# Altium project INV.5KW.OG.PrjPcb (part 2 of 3)

## Sheet INV.Main.SchDoc
size 1549 x 599 mm; SheetNumber: 2; SheetTotal: 3
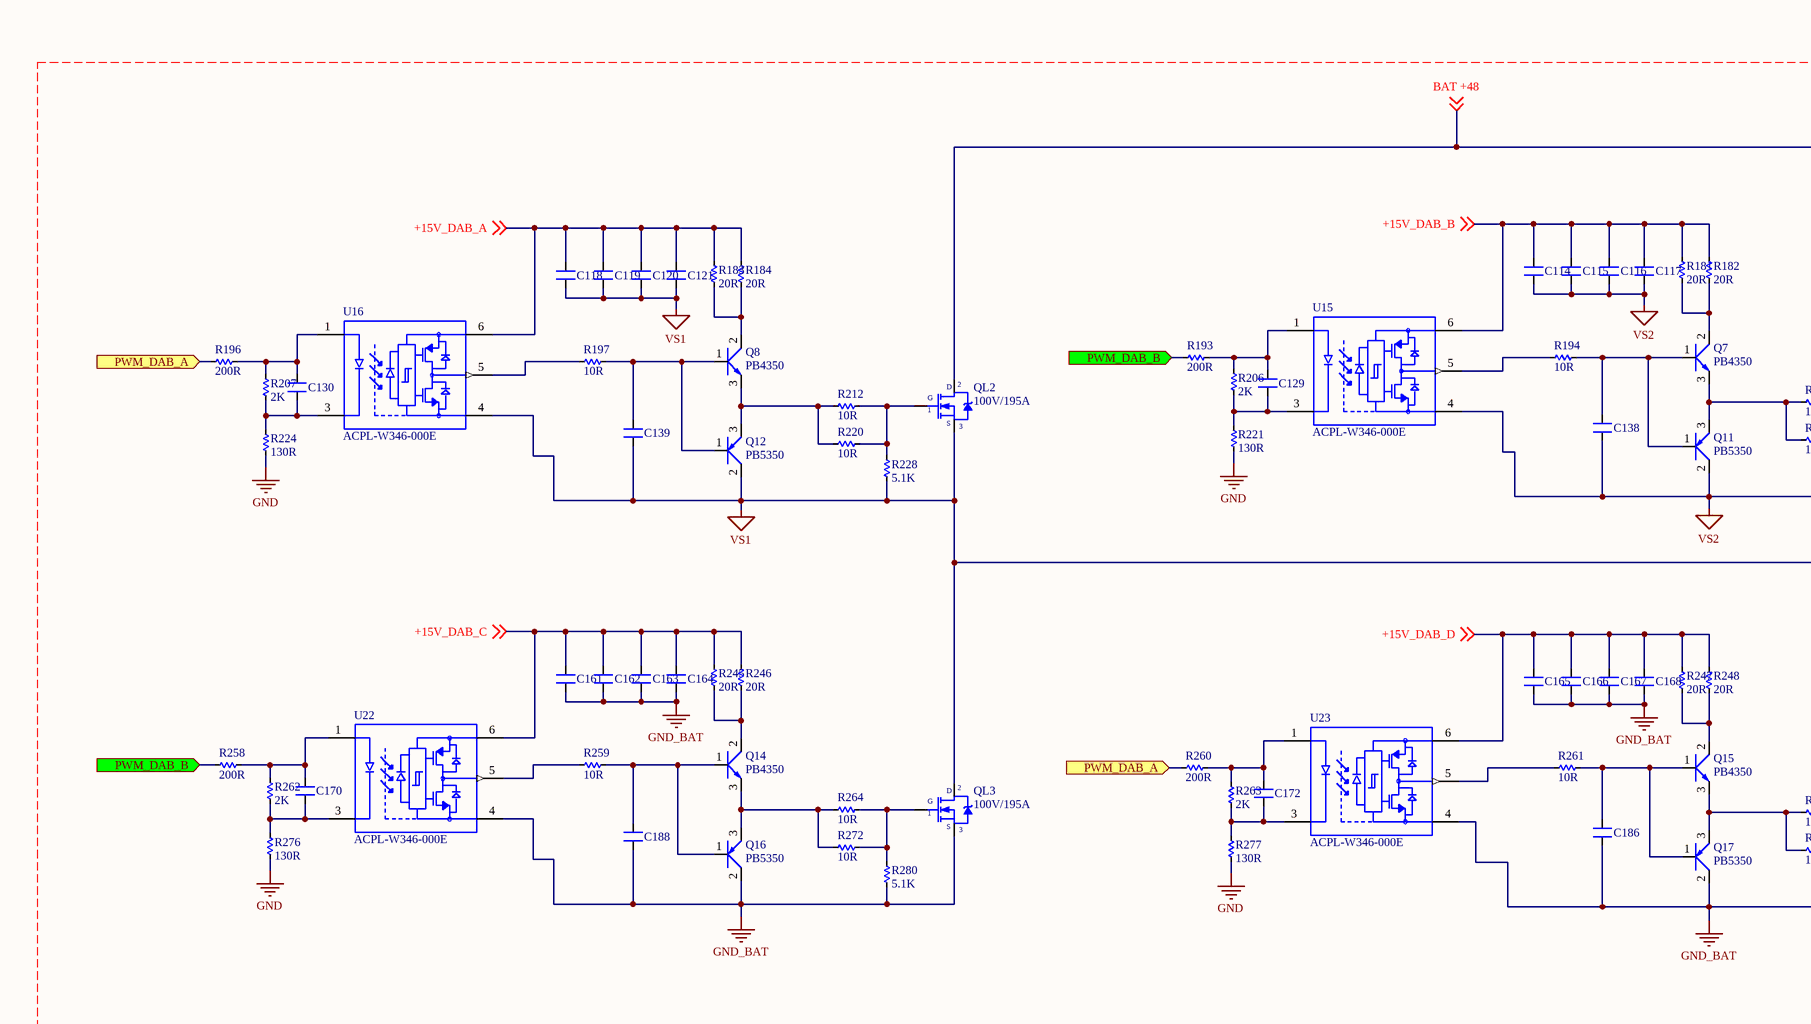
[diagram p3: INV.Main.SchDoc, top column 1 of 4]
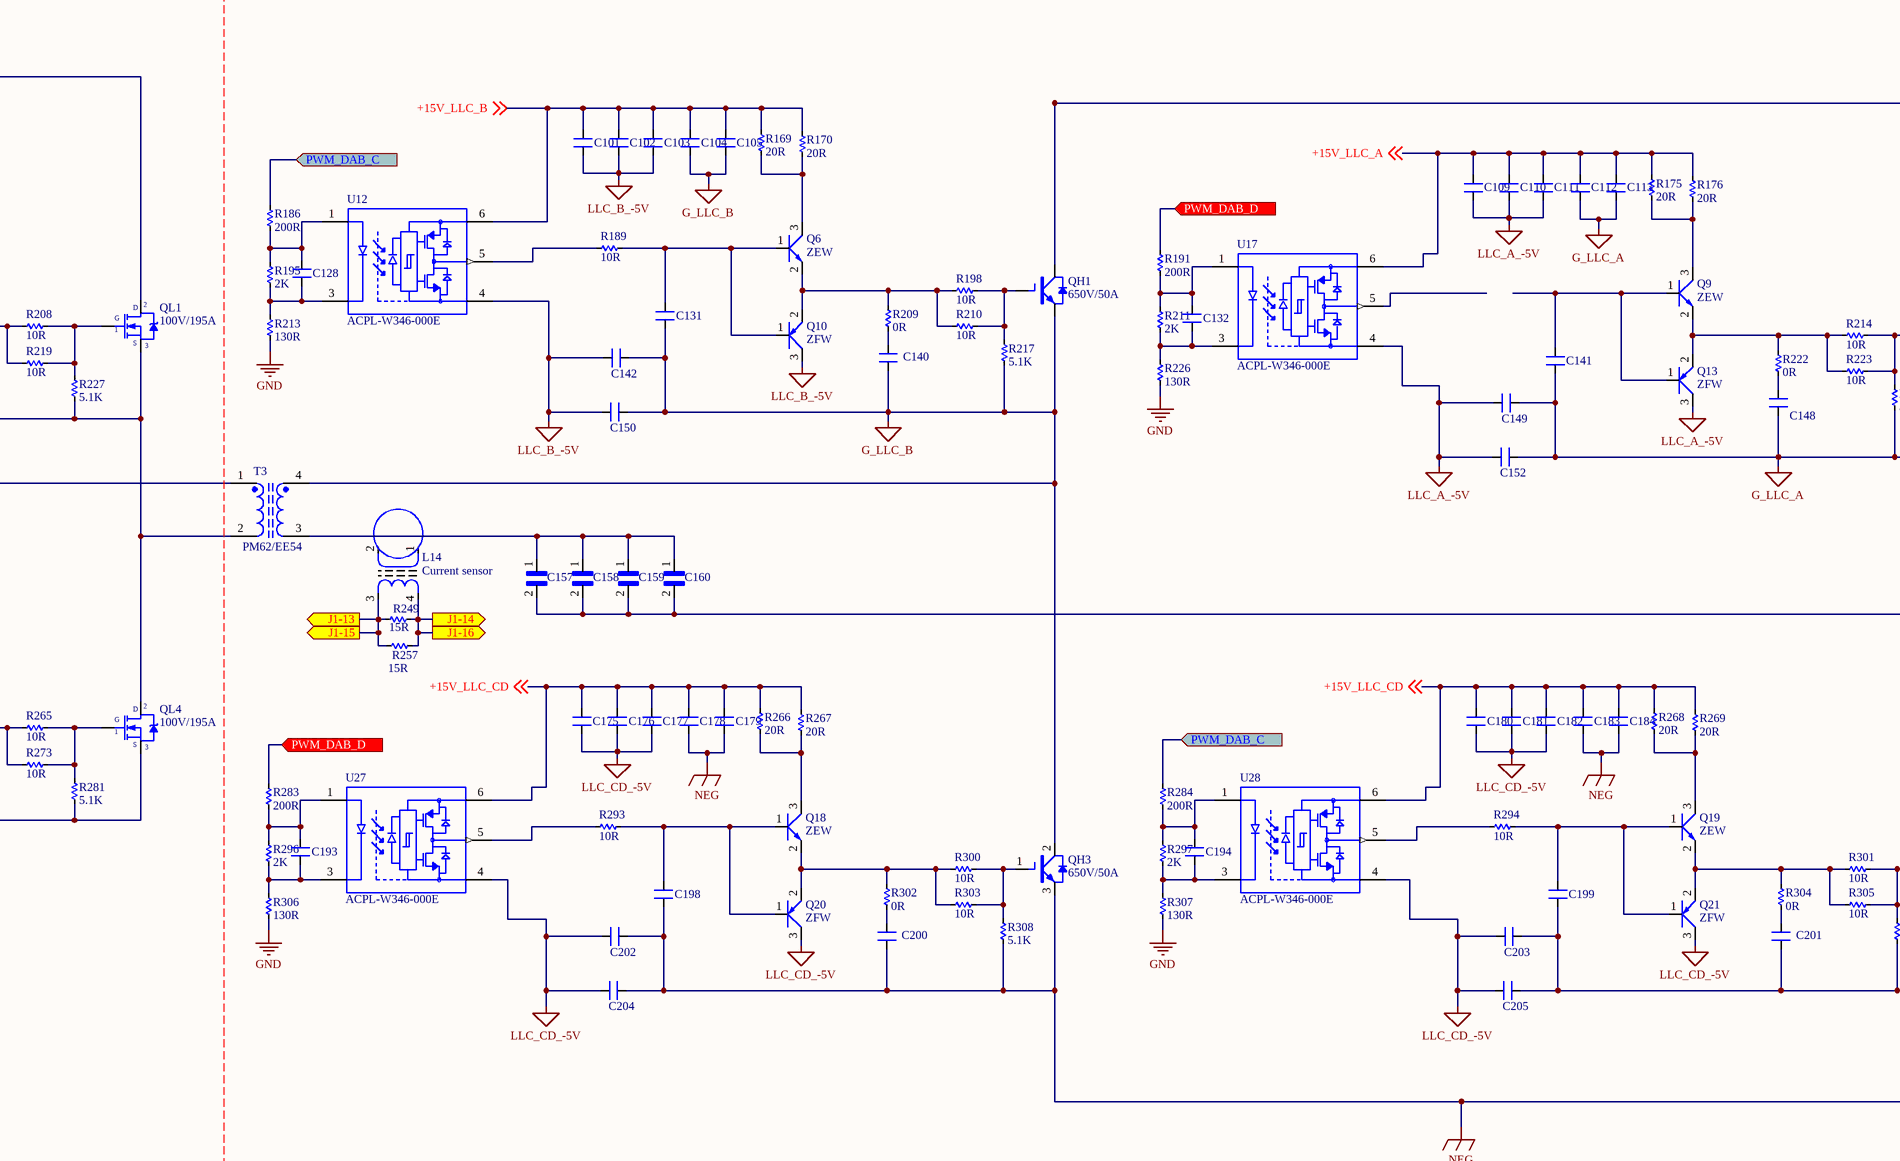
[diagram p4: INV.Main.SchDoc, top column 2 of 4]
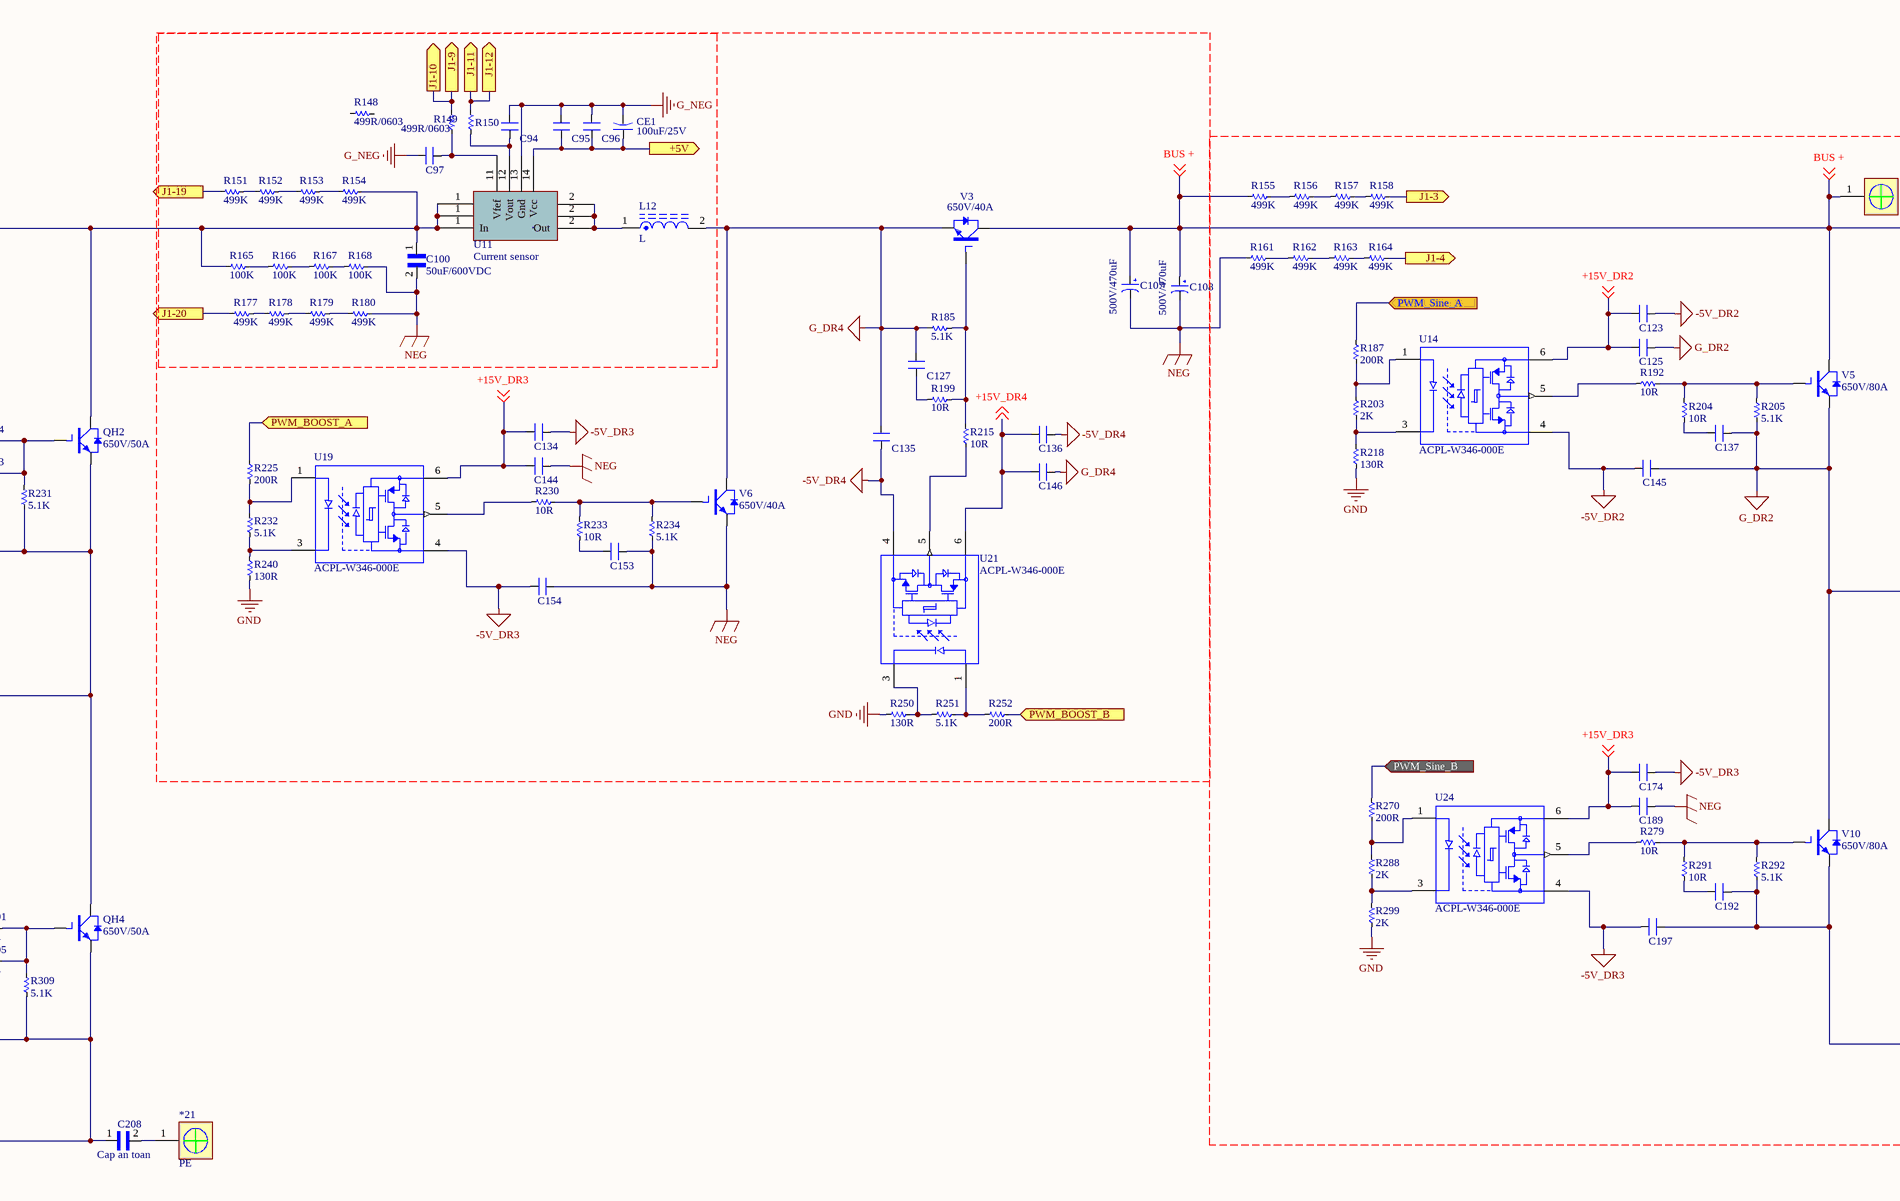
[diagram p5: INV.Main.SchDoc, top column 3 of 4]
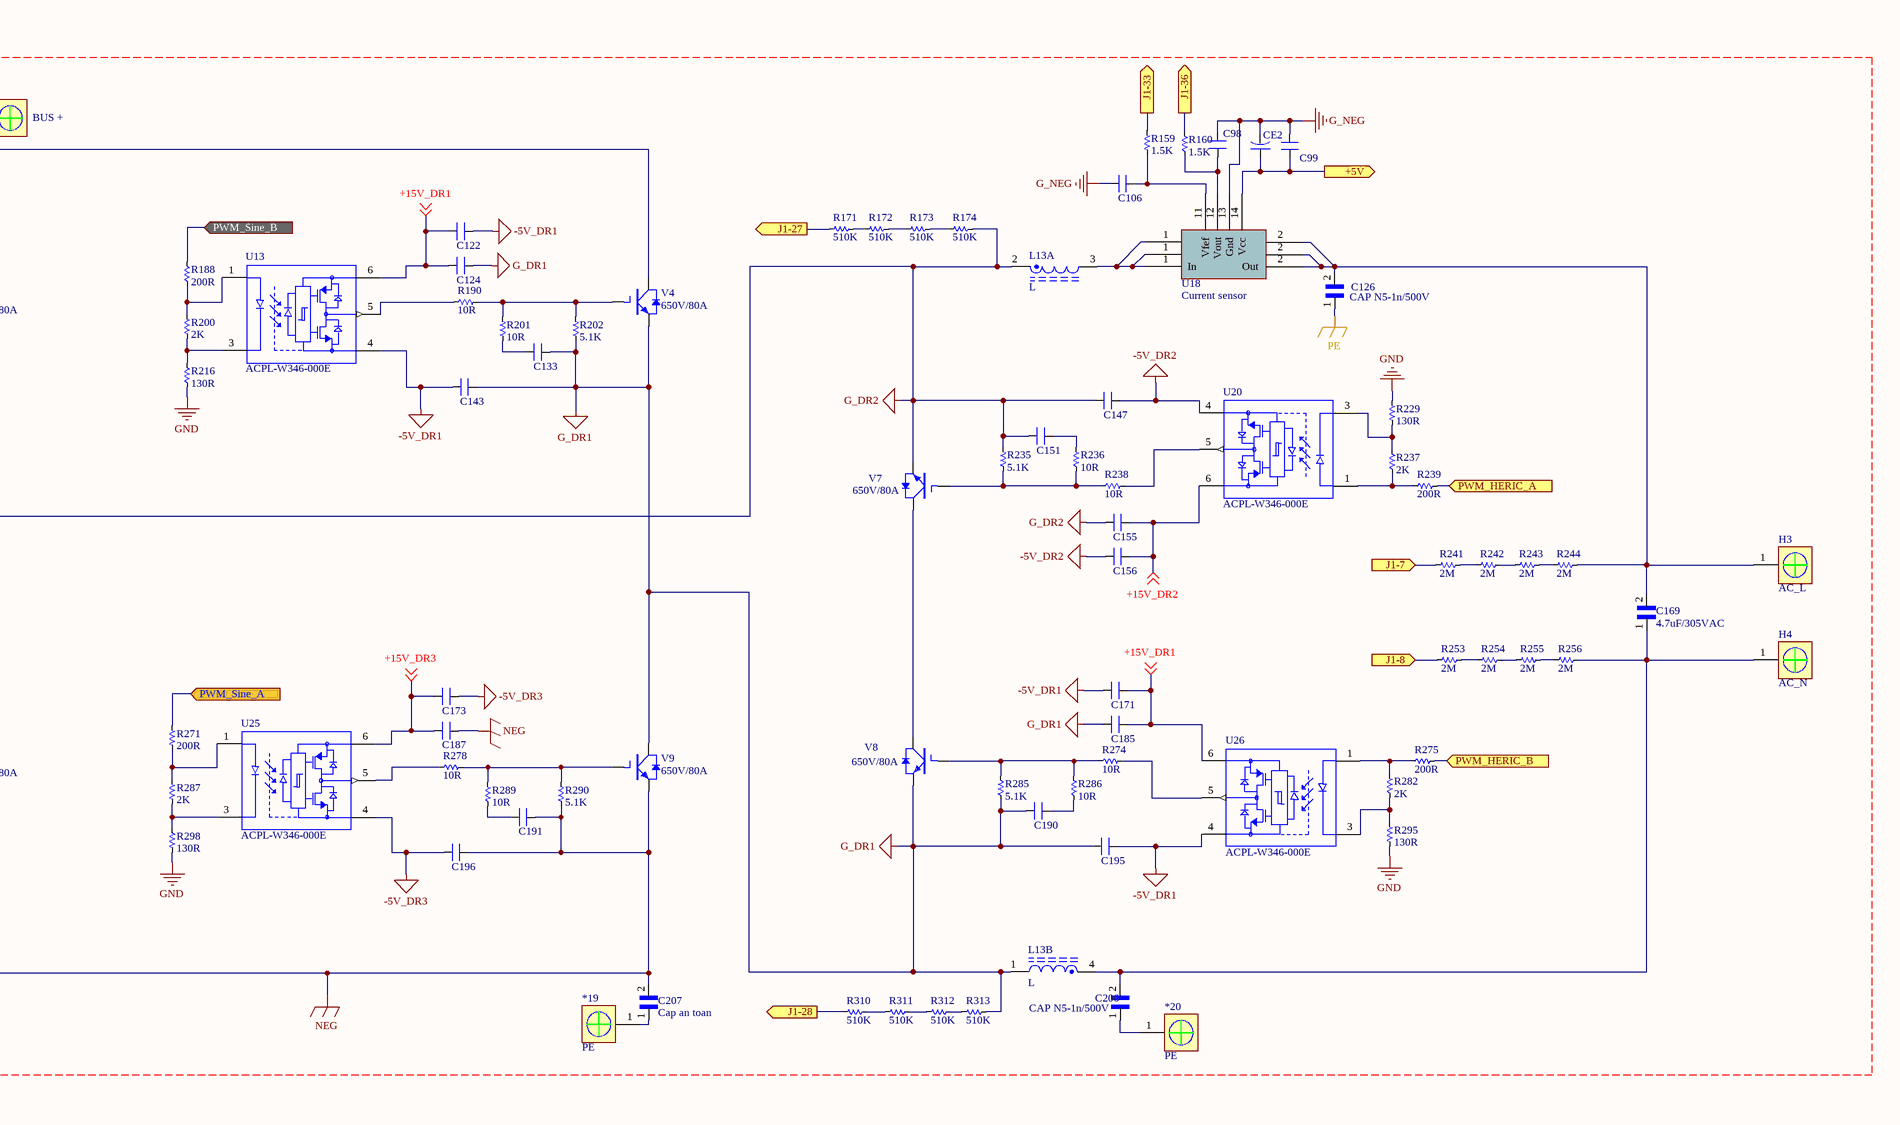
[diagram p6: INV.Main.SchDoc, top column 4 of 4]
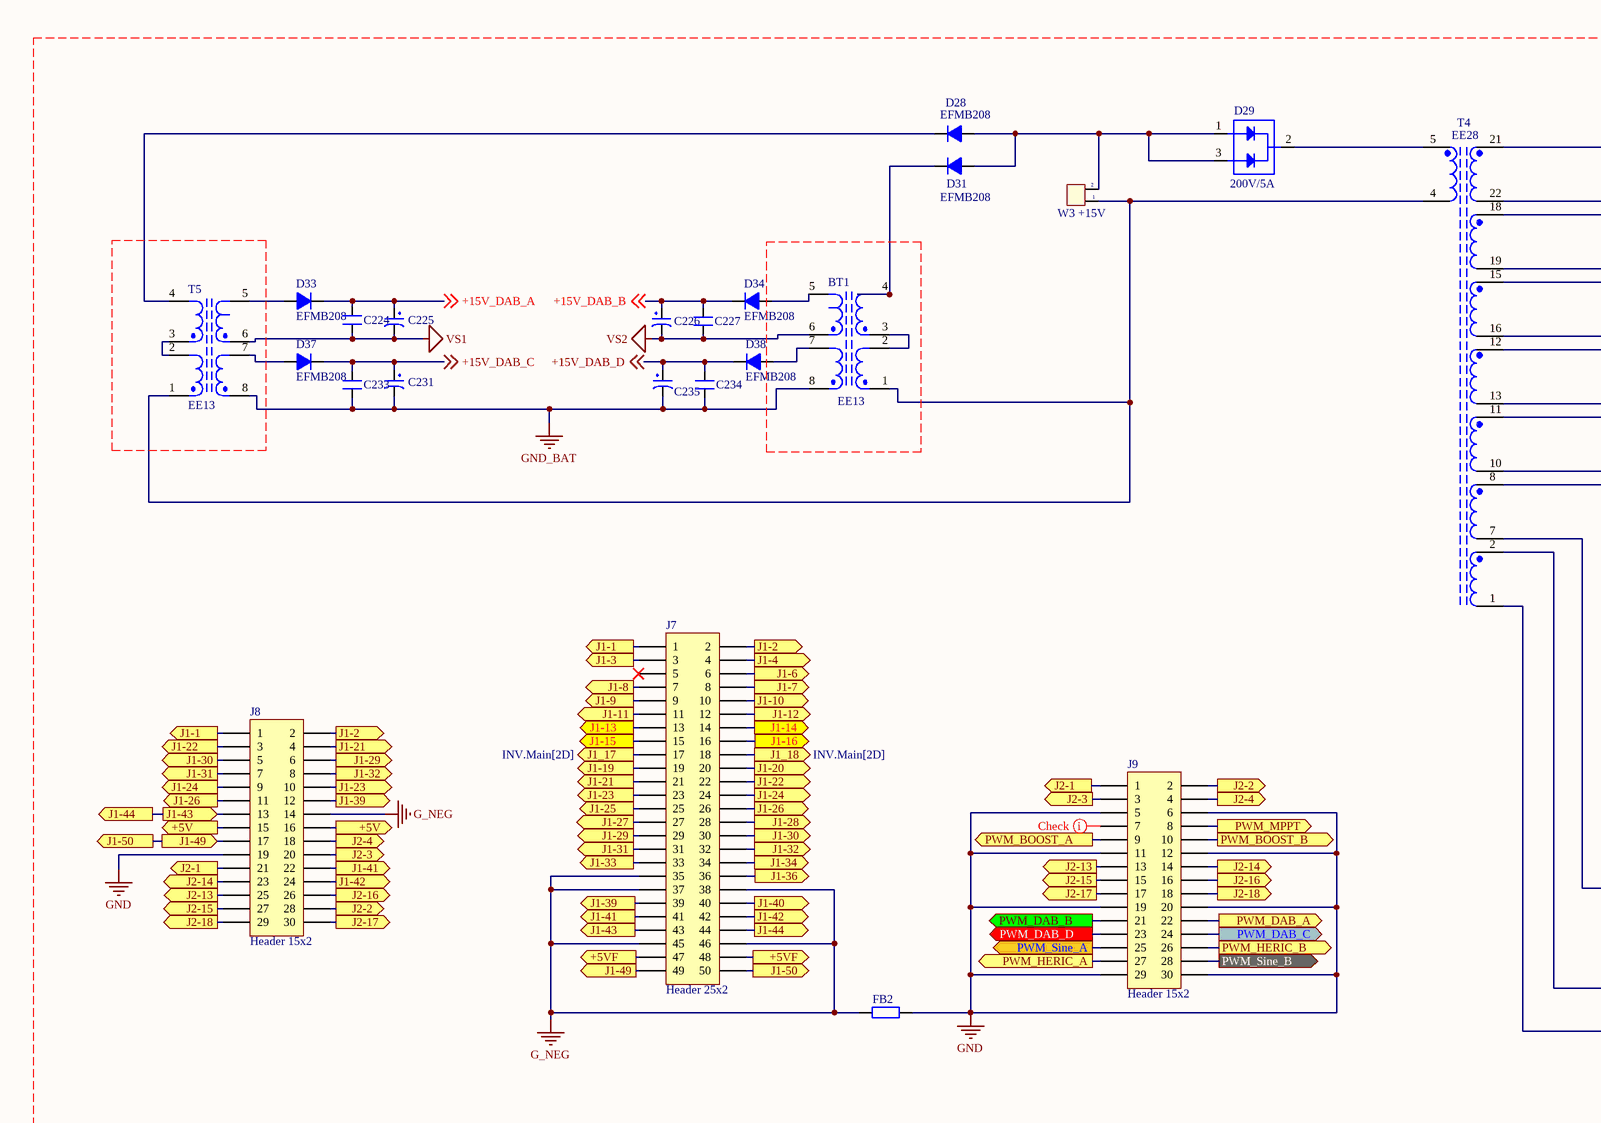
[diagram p7: INV.Main.SchDoc, bottom column 1 of 4]
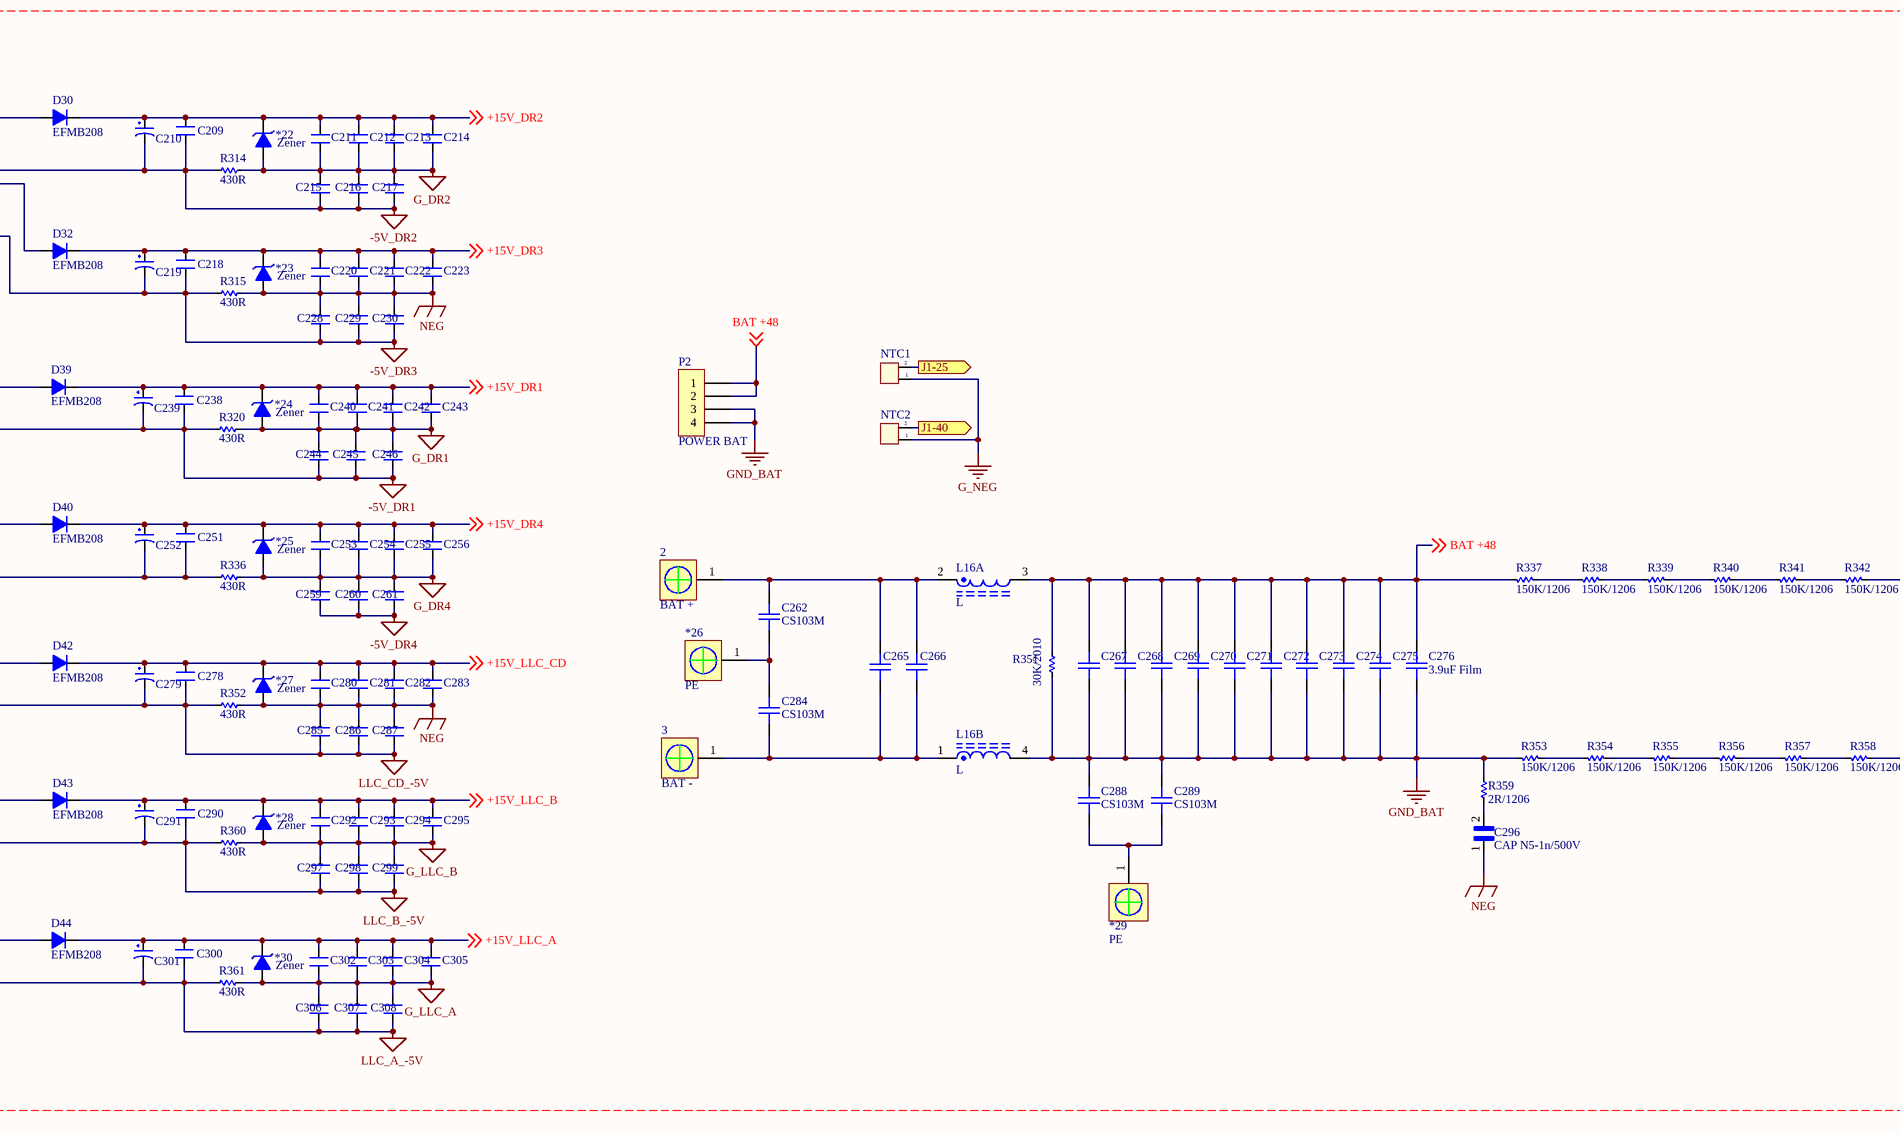
[diagram p8: INV.Main.SchDoc, bottom column 2 of 4]
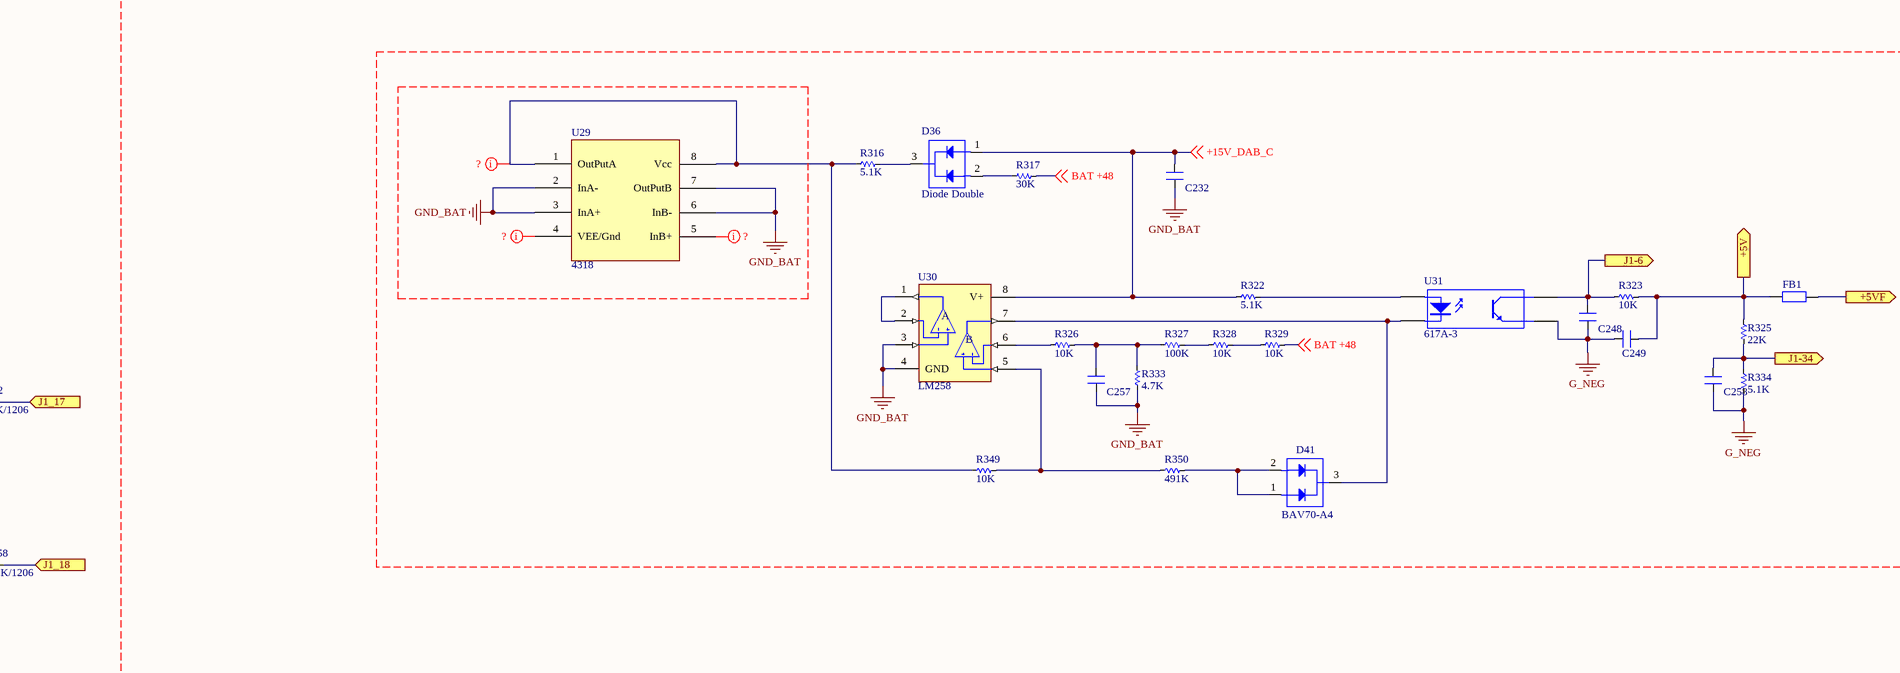
[diagram p9: INV.Main.SchDoc, bottom column 3 of 4]
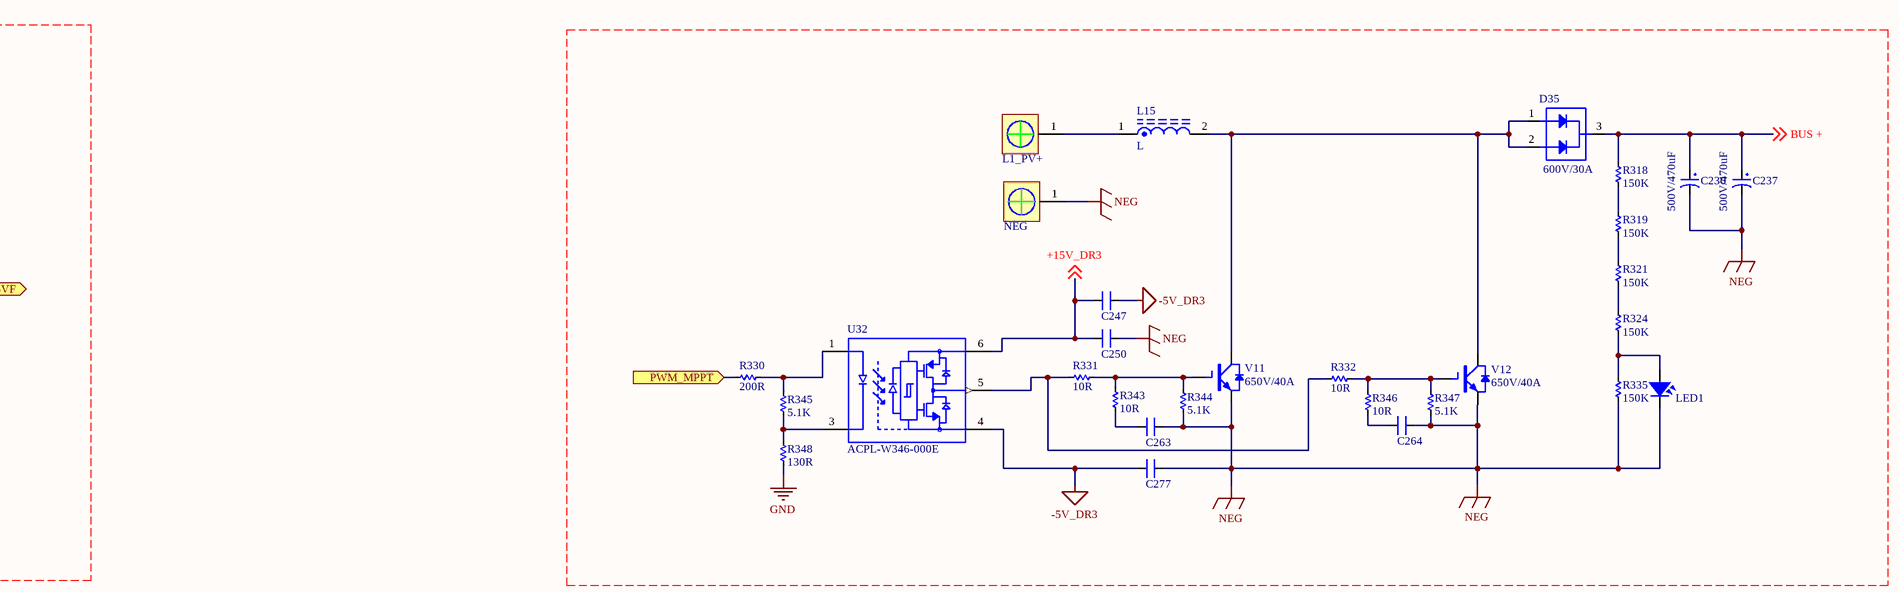
[diagram p10: INV.Main.SchDoc, bottom column 4 of 4]

### Parts
2  BAT +  [Copper Pipe]
3  BAT -  [Copper Pipe]
*19  PE  [Copper Pipe]
*20  PE  [Copper Pipe]
*21  PE  [Copper Pipe]
*22  Zener  [SMA]
*23  Zener  [SMA]
*24  Zener  [SMA]
*25  Zener  [SMA]
*26  PE  [Copper Pipe]
*27  Zener  [SMA]
*28  Zener  [SMA]
*29  PE  [Copper Pipe]
*30  Zener  [SMA]
BT1  EE13  [Transformer EE13]
C94  0805  [CAP-SMD-0805 EX]  (value not drawn)
C95  0805  [CAP-SMD-0805 EX]  (value not drawn)
C96  0805  [CAP-SMD-0805 EX]  (value not drawn)
C97  0805  [CAP-SMD-0805 EX]  (value not drawn)
C98  0805  [CAP-SMD-0805 EX]  (value not drawn)
C99  0805  [CAP-SMD-0805 EX]  (value not drawn)
C100  50uF/600VDC  [CAP C3D 35x46x35mm]
C101  0805  [CAP-SMD-0805 EX]  (value not drawn)
C102  0805  [CAP-SMD-0805 EX]  (value not drawn)
C103  0805  [CAP-SMD-0805 EX]  (value not drawn)
C104  0805  [CAP-SMD-0805 EX]  (value not drawn)
C105  0805  [CAP-SMD-0805 EX]  (value not drawn)
C106  0805  [CAP-SMD-0805 EX]  (value not drawn)
C107  500V/470uF  [CAP-35x60mm]
C108  500V/470uF  [CAP-35x60mm]
C109  0805  [CAP-SMD-0805 EX]  (value not drawn)
C110  0805  [CAP-SMD-0805 EX]  (value not drawn)
C111  0805  [CAP-SMD-0805 EX]  (value not drawn)
C112  0805  [CAP-SMD-0805 EX]  (value not drawn)
C113  0805  [CAP-SMD-0805 EX]  (value not drawn)
C114  0805  [CAP-SMD-0805 EX]  (value not drawn)
C115  0805  [CAP-SMD-0805 EX]  (value not drawn)
C116  0805  [CAP-SMD-0805 EX]  (value not drawn)
C117  0805  [CAP-SMD-0805 EX]  (value not drawn)
C118  0805  [CAP-SMD-0805 EX]  (value not drawn)
C119  0805  [CAP-SMD-0805 EX]  (value not drawn)
C120  0805  [CAP-SMD-0805 EX]  (value not drawn)
C121  0805  [CAP-SMD-0805 EX]  (value not drawn)
C122  0805  [CAP-SMD-0805 EX]  (value not drawn)
C123  0805  [CAP-SMD-0805 EX]  (value not drawn)
C124  0805  [CAP-SMD-0805 EX]  (value not drawn)
C125  0805  [CAP-SMD-0805 EX]  (value not drawn)
C126  CAP N5-1n/500V  [CAP 1nF/500VAC, Y1]
C127  0805  [CAP-SMD-0805 EX]  (value not drawn)
C128  0805  [CAP-SMD-0805 EX]  (value not drawn)
C129  0805  [CAP-SMD-0805 EX]  (value not drawn)
C130  0805  [CAP-SMD-0805 EX]  (value not drawn)
C131  0805  [CAP-SMD-0805 EX]  (value not drawn)
C132  0805  [CAP-SMD-0805 EX]  (value not drawn)
C133  0805  [CAP-SMD-0805 EX]  (value not drawn)
C134  0805  [CAP-SMD-0805 EX]  (value not drawn)
C135  0805  [CAP-SMD-0805 EX]  (value not drawn)
C136  0805  [CAP-SMD-0805 EX]  (value not drawn)
C137  0805  [CAP-SMD-0805 EX]  (value not drawn)
C138  0805  [CAP-SMD-0805 EX]  (value not drawn)
C139  0805  [CAP-SMD-0805 EX]  (value not drawn)
C140  Tu dan gom  [CAP-SMD-0805 EX]  (value not drawn)
C141  0805  [CAP-SMD-0805 EX]  (value not drawn)
C142  0805  [CAP-SMD-0805 EX]  (value not drawn)
C143  0805  [CAP-SMD-0805 EX]  (value not drawn)
C144  0805  [CAP-SMD-0805 EX]  (value not drawn)
C145  0805  [CAP-SMD-0805 EX]  (value not drawn)
C146  0805  [CAP-SMD-0805 EX]  (value not drawn)
C147  0805  [CAP-SMD-0805 EX]  (value not drawn)
C148  0805  [CAP-SMD-0805 EX]  (value not drawn)
C149  0805  [CAP-SMD-0805 EX]  (value not drawn)
C150  0805  [CAP-SMD-0805 EX]  (value not drawn)
C151  0805  [CAP-SMD-0805 EX]  (value not drawn)
C152  0805  [CAP-SMD-0805 EX]  (value not drawn)
C153  0805  [CAP-SMD-0805 EX]  (value not drawn)
C154  0805  [CAP-SMD-0805 EX]  (value not drawn)
C155  0805  [CAP-SMD-0805 EX]  (value not drawn)
C156  0805  [CAP-SMD-0805 EX]  (value not drawn)
C157  CBB 150nF/630V  [CAP MMPK82]  (value not drawn)
C158  CBB 150nF/630V  [CAP MMPK82]  (value not drawn)
C159  CBB 150nF/630V  [CAP MMPK82]  (value not drawn)
C160  CBB 150nF/630V  [CAP MMPK82]  (value not drawn)
C161  0805  [CAP-SMD-0805 EX]  (value not drawn)
C162  0805  [CAP-SMD-0805 EX]  (value not drawn)
C163  0805  [CAP-SMD-0805 EX]  (value not drawn)
C164  0805  [CAP-SMD-0805 EX]  (value not drawn)
C165  0805  [CAP-SMD-0805 EX]  (value not drawn)
C166  0805  [CAP-SMD-0805 EX]  (value not drawn)
C167  0805  [CAP-SMD-0805 EX]  (value not drawn)
C168  0805  [CAP-SMD-0805 EX]  (value not drawn)
C169  4.7uF/305VAC  [CAP X2 B32924]
C170  0805  [CAP-SMD-0805 EX]  (value not drawn)
C171  0805  [CAP-SMD-0805 EX]  (value not drawn)
C172  0805  [CAP-SMD-0805 EX]  (value not drawn)
C173  0805  [CAP-SMD-0805 EX]  (value not drawn)
C174  0805  [CAP-SMD-0805 EX]  (value not drawn)
C175  0805  [CAP-SMD-0805 EX]  (value not drawn)
C176  0805  [CAP-SMD-0805 EX]  (value not drawn)
C177  0805  [CAP-SMD-0805 EX]  (value not drawn)
C178  0805  [CAP-SMD-0805 EX]  (value not drawn)
C179  0805  [CAP-SMD-0805 EX]  (value not drawn)
C180  0805  [CAP-SMD-0805 EX]  (value not drawn)
C181  0805  [CAP-SMD-0805 EX]  (value not drawn)
C182  0805  [CAP-SMD-0805 EX]  (value not drawn)
C183  0805  [CAP-SMD-0805 EX]  (value not drawn)
C184  0805  [CAP-SMD-0805 EX]  (value not drawn)
C185  0805  [CAP-SMD-0805 EX]  (value not drawn)
C186  0805  [CAP-SMD-0805 EX]  (value not drawn)
C187  0805  [CAP-SMD-0805 EX]  (value not drawn)
C188  0805  [CAP-SMD-0805 EX]  (value not drawn)
C189  0805  [CAP-SMD-0805 EX]  (value not drawn)
C190  0805  [CAP-SMD-0805 EX]  (value not drawn)
C191  0805  [CAP-SMD-0805 EX]  (value not drawn)
C192  0805  [CAP-SMD-0805 EX]  (value not drawn)
C193  0805  [CAP-SMD-0805 EX]  (value not drawn)
C194  0805  [CAP-SMD-0805 EX]  (value not drawn)
C195  0805  [CAP-SMD-0805 EX]  (value not drawn)
C196  0805  [CAP-SMD-0805 EX]  (value not drawn)
C197  0805  [CAP-SMD-0805 EX]  (value not drawn)
C198  0805  [CAP-SMD-0805 EX]  (value not drawn)
C199  0805  [CAP-SMD-0805 EX]  (value not drawn)
C200  Tu dan gom  [CAP-SMD-0805 EX]  (value not drawn)
C201  Tu dan gom  [CAP-SMD-0805 EX]  (value not drawn)
C202  0805  [CAP-SMD-0805 EX]  (value not drawn)
C203  0805  [CAP-SMD-0805 EX]  (value not drawn)
C204  0805  [CAP-SMD-0805 EX]  (value not drawn)
C205  0805  [CAP-SMD-0805 EX]  (value not drawn)
C206  CAP N5-1n/500V  [CAP 1nF/500VAC, Y1]
C207  Cap an toan  [Cap an toan]
C208  Cap an toan  [Cap an toan]
C209  Tu dan gom  [CAP-SMD-0805 EX]  (value not drawn)
C210  100uF/25V  [CA-6-P2.5]  (value not drawn)
C211  Tu dan gom  [CAP-SMD-0805 EX]  (value not drawn)
C212  Tu dan gom  [CAP-SMD-0805 EX]  (value not drawn)
C213  Tu dan gom  [CAP-SMD-0805 EX]  (value not drawn)
C214  Tu dan gom  [CAP-SMD-0805 EX]  (value not drawn)
C215  Tu dan gom  [CAP-SMD-0805 EX]  (value not drawn)
C216  Tu dan gom  [CAP-SMD-0805 EX]  (value not drawn)
C217  Tu dan gom  [CAP-SMD-0805 EX]  (value not drawn)
C218  Tu dan gom  [CAP-SMD-0805 EX]  (value not drawn)
C219  100uF/25V  [CA-6-P2.5]  (value not drawn)
C220  Tu dan gom  [CAP-SMD-0805 EX]  (value not drawn)
C221  Tu dan gom  [CAP-SMD-0805 EX]  (value not drawn)
C222  Tu dan gom  [CAP-SMD-0805 EX]  (value not drawn)
C223  Tu dan gom  [CAP-SMD-0805 EX]  (value not drawn)
C224  0805  [CAP-SMD-0805 EX]  (value not drawn)
C225  100uF/25V  [CA-6-P2.5]  (value not drawn)
C226  100uF/25V  [CA-6-P2.5]  (value not drawn)
C227  0805  [CAP-SMD-0805 EX]  (value not drawn)
C228  Tu dan gom  [CAP-SMD-0805 EX]  (value not drawn)
C229  Tu dan gom  [CAP-SMD-0805 EX]  (value not drawn)
C230  Tu dan gom  [CAP-SMD-0805 EX]  (value not drawn)
C231  100uF/25V  [CA-6-P2.5]  (value not drawn)
C232  0805  [CAP-SMD-0805 EX]  (value not drawn)
C233  0805  [CAP-SMD-0805 EX]  (value not drawn)
C234  0805  [CAP-SMD-0805 EX]  (value not drawn)
C235  100uF/25V  [CA-6-P2.5]  (value not drawn)
C236  500V/470uF  [CAP-10X17-N]
C237  500V/470uF  [CAP-10X17-N]
C238  Tu dan gom  [CAP-SMD-0805 EX]  (value not drawn)
C239  100uF/25V  [CA-6-P2.5]  (value not drawn)
C240  Tu dan gom  [CAP-SMD-0805 EX]  (value not drawn)
C241  Tu dan gom  [CAP-SMD-0805 EX]  (value not drawn)
C242  Tu dan gom  [CAP-SMD-0805 EX]  (value not drawn)
C243  Tu dan gom  [CAP-SMD-0805 EX]  (value not drawn)
C244  Tu dan gom  [CAP-SMD-0805 EX]  (value not drawn)
C245  Tu dan gom  [CAP-SMD-0805 EX]  (value not drawn)
C246  Tu dan gom  [CAP-SMD-0805 EX]  (value not drawn)
C247  0805  [CAP-SMD-0805 EX]  (value not drawn)
C248  0805  [CAP-SMD-0805 EX]  (value not drawn)
C249  0805  [CAP-SMD-0805 EX]  (value not drawn)
C250  0805  [CAP-SMD-0805 EX]  (value not drawn)
C251  Tu dan gom  [CAP-SMD-0805 EX]  (value not drawn)
C252  100uF/25V  [CA-6-P2.5]  (value not drawn)
C253  Tu dan gom  [CAP-SMD-0805 EX]  (value not drawn)
C254  Tu dan gom  [CAP-SMD-0805 EX]  (value not drawn)
C255  Tu dan gom  [CAP-SMD-0805 EX]  (value not drawn)
C256  Tu dan gom  [CAP-SMD-0805 EX]  (value not drawn)
C257  0805  [CAP-SMD-0805 EX]  (value not drawn)
C258  0805  [CAP-SMD-0805 EX]  (value not drawn)
C259  Tu dan gom  [CAP-SMD-0805 EX]  (value not drawn)
C260  Tu dan gom  [CAP-SMD-0805 EX]  (value not drawn)
C261  Tu dan gom  [CAP-SMD-0805 EX]  (value not drawn)
C262  CS103M  [Cap an toan CS103M]
C263  0805  [CAP-SMD-0805 EX]  (value not drawn)
C264  0805  [CAP-SMD-0805 EX]  (value not drawn)
C265  (no value)  [CAP-SMD-1206 EX]
C266  (no value)  [CAP-SMD-1206 EX]
C267  3.9uF Film  [Cap Film CL21]  (value not drawn)
C268  395K  [Cap Film CL21]  (value not drawn)
C269  395K  [Cap Film CL21]  (value not drawn)
C270  395K  [Cap Film CL21]  (value not drawn)
C271  395K  [Cap Film CL21]  (value not drawn)
C272  395K  [Cap Film CL21]  (value not drawn)
C273  395K  [Cap Film CL21]  (value not drawn)
C274  395K  [Cap Film CL21]  (value not drawn)
C275  395K  [Cap Film CL21]  (value not drawn)
C276  3.9uF Film  [Cap Film CL21]
C277  0805  [CAP-SMD-0805 EX]  (value not drawn)
C278  Tu dan gom  [CAP-SMD-0805 EX]  (value not drawn)
C279  100uF/25V  [CA-6-P2.5]  (value not drawn)
C280  Tu dan gom  [CAP-SMD-0805 EX]  (value not drawn)
C281  Tu dan gom  [CAP-SMD-0805 EX]  (value not drawn)
C282  Tu dan gom  [CAP-SMD-0805 EX]  (value not drawn)
C283  Tu dan gom  [CAP-SMD-0805 EX]  (value not drawn)
C284  CS103M  [Cap an toan CS103M]
C285  Tu dan gom  [CAP-SMD-0805 EX]  (value not drawn)
C286  Tu dan gom  [CAP-SMD-0805 EX]  (value not drawn)
C287  Tu dan gom  [CAP-SMD-0805 EX]  (value not drawn)
C288  CS103M  [Cap an toan CS103M]
C289  CS103M  [Cap an toan CS103M]
C290  Tu dan gom  [CAP-SMD-0805 EX]  (value not drawn)
C291  100uF/25V  [CA-6-P2.5]  (value not drawn)
C292  Tu dan gom  [CAP-SMD-0805 EX]  (value not drawn)
C293  Tu dan gom  [CAP-SMD-0805 EX]  (value not drawn)
C294  Tu dan gom  [CAP-SMD-0805 EX]  (value not drawn)
C295  Tu dan gom  [CAP-SMD-0805 EX]  (value not drawn)
C296  CAP N5-1n/500V  [CAP 1nF/500VAC, Y1]
C297  Tu dan gom  [CAP-SMD-0805 EX]  (value not drawn)
C298  Tu dan gom  [CAP-SMD-0805 EX]  (value not drawn)
C299  Tu dan gom  [CAP-SMD-0805 EX]  (value not drawn)
C300  Tu dan gom  [CAP-SMD-0805 EX]  (value not drawn)
C301  100uF/25V  [CA-6-P2.5]  (value not drawn)
C302  Tu dan gom  [CAP-SMD-0805 EX]  (value not drawn)
C303  Tu dan gom  [CAP-SMD-0805 EX]  (value not drawn)
C304  Tu dan gom  [CAP-SMD-0805 EX]  (value not drawn)
C305  Tu dan gom  [CAP-SMD-0805 EX]  (value not drawn)
C306  Tu dan gom  [CAP-SMD-0805 EX]  (value not drawn)
C307  Tu dan gom  [CAP-SMD-0805 EX]  (value not drawn)
C308  Tu dan gom  [CAP-SMD-0805 EX]  (value not drawn)
CE1  100uF/25V  [CA-6-P2.5]
CE2  100uF/25V  [CA-6-P2.5]  (value not drawn)
D28  EFMB208  [SMB]
D29  200V/5A  [TO252-123]
D30  EFMB208  [SMB]
D31  EFMB208  [SMB]
D32  EFMB208  [SMB]
D33  EFMB208  [SMB]
D34  EFMB208  [SMB]
D35  600V/30A  [TO-247-Diode]
D36  Diode Double  [SOT-23]
D37  EFMB208  [SMB]
D38  EFMB208  [SMB]
D39  EFMB208  [SMB]
D40  EFMB208  [SMB]
D41  BAV70-A4  [SOT-23]
D42  EFMB208  [SMB]
D43  EFMB208  [SMB]
D44  EFMB208  [SMB]
FB1  (no value)  [RES-SMD-1206 EX]
FB2  (no value)  [RES-SMD-1206 EX]
H3  AC_L  [Copper Pipe]
H4  AC_N  [Copper Pipe]
J6  W3 +15V  [Header2]
J7  Header 25x2  [Header 2x50]
J8  Header 15x2  [Header 2x15]
J9  Header 15x2  [Header 2x15]
L12  L  [LBOSHOG-V1]
L13  L  [LSINEOG-V1]  (parts A,B of 2)
L14  Current sensor  [Bien ap do Current]
L15  L  [LBOSPVOG-V1]
L16  L  [LBATOG-V1]  (parts A,B of 2)
LED1  LED  [LED-0805-Red]  (value not drawn)
NTC1  Temp Sensor  [JP 1x2 CT]  (value not drawn)
NTC2  Temp Sensor  [JP 1x2 CT]  (value not drawn)
P2  POWER BAT  [XH2.54M-4]
PV_+2  BUS +  [Copper Pipe]
PV_+3  L1_PV+  [Copper Pipe]
PV_+4  NEG  [Copper Pipe]
Q6  ZEW  [SOT-23]
Q7  PB4350  [SOT223]
Q8  PB4350  [SOT223]
Q9  ZEW  [SOT-23]
Q10  ZFW  [SOT-23]
Q11  PB5350  [SOT223]
Q12  PB5350  [SOT223]
Q13  ZFW  [SOT-23]
Q14  PB4350  [SOT223]
Q15  PB4350  [SOT223]
Q16  PB5350  [SOT223]
Q17  PB5350  [SOT223]
Q18  ZEW  [SOT-23]
Q19  ZEW  [SOT-23]
Q20  ZFW  [SOT-23]
Q21  ZFW  [SOT-23]
QH1  650V/50A  [TO-247_1]
QH2  650V/50A  [TO-247_1]
QH3  650V/50A  [TO-247_1]
QH4  650V/50A  [TO-247_1]
QL1  100V/195A  [TO-247]
QL2  100V/195A  [TO-247]
QL3  100V/195A  [TO-247]
QL4  100V/195A  [TO-247]
R148  499R/0603  [RES-SMD-1206 EX]
R149  499R/0603  [RES-SMD-1206 EX]
R150  499R/0603  [RES-SMD-1206 EX]  (value not drawn)
R151  499K  [RES-SMD-1206 EX]
R152  499K  [RES-SMD-1206 EX]
R153  499K  [RES-SMD-1206 EX]
R154  499K  [RES-SMD-1206 EX]
R155  499K  [RES-SMD-1206 EX]
R156  499K  [RES-SMD-1206 EX]
R157  499K  [RES-SMD-1206 EX]
R158  499K  [RES-SMD-1206 EX]
R159  1.5K  [RES-SMD-0805 EX]
R160  1.5K  [RES-SMD-0805 EX]
R161  499K  [RES-SMD-1206 EX]
R162  499K  [RES-SMD-1206 EX]
R163  499K  [RES-SMD-1206 EX]
R164  499K  [RES-SMD-1206 EX]
R165  100K  [RES-SMD-1206 EX]
R166  100K  [RES-SMD-1206 EX]
R167  100K  [RES-SMD-1206 EX]
R168  100K  [RES-SMD-1206 EX]
R169  20R  [RES-SMD-0805 EX]
R170  20R  [RES-SMD-0805 EX]
R171  510K  [RES-SMD-1206 EX]
R172  510K  [RES-SMD-1206 EX]
R173  510K  [RES-SMD-1206 EX]
R174  510K  [RES-SMD-1206 EX]
R175  20R  [RES-SMD-0805 EX]
R176  20R  [RES-SMD-0805 EX]
R177  499K  [RES-SMD-1206 EX]
R178  499K  [RES-SMD-1206 EX]
R179  499K  [RES-SMD-1206 EX]
R180  499K  [RES-SMD-1206 EX]
R181  20R  [RES-SMD-0805 EX]
R182  20R  [RES-SMD-0805 EX]
R183  20R  [RES-SMD-0805 EX]
R184  20R  [RES-SMD-0805 EX]
R185  5.1K  [RES-SMD-0805 EX]
R186  200R  [RES-SMD-0805 EX]
R187  200R  [RES-SMD-0805 EX]
R188  200R  [RES-SMD-0805 EX]
R189  10R  [RES-SMD-0805 EX]
R190  10R  [RES-SMD-0805 EX]
R191  200R  [RES-SMD-0805 EX]
R192  10R  [RES-SMD-0805 EX]
R193  200R  [RES-SMD-0805 EX]
R194  10R  [RES-SMD-0805 EX]
R195  2K  [RES-SMD-0805 EX]
R196  200R  [RES-SMD-0805 EX]
R197  10R  [RES-SMD-0805 EX]
R198  10R  [RES-SMD-0805 EX]
R199  10R  [RES-SMD-0805 EX]
R200  2K  [RES-SMD-0805 EX]
R201  10R  [RES-SMD-0805 EX]
R202  5.1K  [RES-SMD-0805 EX]
R203  2K  [RES-SMD-0805 EX]
R204  10R  [RES-SMD-0805 EX]
R205  5.1K  [RES-SMD-0805 EX]
R206  2K  [RES-SMD-0805 EX]
R207  2K  [RES-SMD-0805 EX]
R208  10R  [RES-SMD-0805 EX]
R209  0R  [RES-SMD-0805 EX]
R210  10R  [RES-SMD-0805 EX]
R211  2K  [RES-SMD-0805 EX]
R212  10R  [RES-SMD-0805 EX]
R213  130R  [RES-SMD-0805 EX]
R214  10R  [RES-SMD-0805 EX]
R215  10R  [RES-SMD-0805 EX]
R216  130R  [RES-SMD-0805 EX]
R217  5.1K  [RES-SMD-0805 EX]
R218  130R  [RES-SMD-0805 EX]
R219  10R  [RES-SMD-0805 EX]
R220  10R  [RES-SMD-0805 EX]
R221  130R  [RES-SMD-0805 EX]
R222  0R  [RES-SMD-0805 EX]
R223  10R  [RES-SMD-0805 EX]
R224  130R  [RES-SMD-0805 EX]
R225  200R  [RES-SMD-0805 EX]
R226  130R  [RES-SMD-0805 EX]
R227  5.1K  [RES-SMD-0805 EX]
R228  5.1K  [RES-SMD-0805 EX]
R229  130R  [RES-SMD-0805 EX]
R230  10R  [RES-SMD-0805 EX]
R231  5.1K  [RES-SMD-0805 EX]
R232  5.1K  [RES-SMD-0805 EX]
R233  10R  [RES-SMD-0805 EX]
R234  5.1K  [RES-SMD-0805 EX]
R235  5.1K  [RES-SMD-0805 EX]
R236  10R  [RES-SMD-0805 EX]
R237  2K  [RES-SMD-0805 EX]
R238  10R  [RES-SMD-0805 EX]
R239  200R  [RES-SMD-0805 EX]
R240  130R  [RES-SMD-0805 EX]
R241  2M  [RES-SMD-1206 EX]
R242  2M  [RES-SMD-1206 EX]
R243  2M  [RES-SMD-1206 EX]
R244  2M  [RES-SMD-1206 EX]
R245  20R  [RES-SMD-0805 EX]
R246  20R  [RES-SMD-0805 EX]
R247  20R  [RES-SMD-0805 EX]
R248  20R  [RES-SMD-0805 EX]
R249  15R  [R1206]
R250  130R  [RES-SMD-0805 EX]
R251  5.1K  [RES-SMD-0805 EX]
R252  200R  [RES-SMD-0805 EX]
R253  2M  [RES-SMD-1206 EX]
R254  2M  [RES-SMD-1206 EX]
R255  2M  [RES-SMD-1206 EX]
R256  2M  [RES-SMD-1206 EX]
R257  15R  [R1206]
R258  200R  [RES-SMD-0805 EX]
R259  10R  [RES-SMD-0805 EX]
R260  200R  [RES-SMD-0805 EX]
R261  10R  [RES-SMD-0805 EX]
R262  2K  [RES-SMD-0805 EX]
R263  2K  [RES-SMD-0805 EX]
R264  10R  [RES-SMD-0805 EX]
R265  10R  [RES-SMD-0805 EX]
R266  20R  [RES-SMD-0805 EX]
R267  20R  [RES-SMD-0805 EX]
R268  20R  [RES-SMD-0805 EX]
R269  20R  [RES-SMD-0805 EX]
R270  200R  [RES-SMD-0805 EX]
R271  200R  [RES-SMD-0805 EX]
R272  10R  [RES-SMD-0805 EX]
R273  10R  [RES-SMD-0805 EX]
R274  10R  [RES-SMD-0805 EX]
R275  200R  [RES-SMD-0805 EX]
R276  130R  [RES-SMD-0805 EX]
R277  130R  [RES-SMD-0805 EX]
R278  10R  [RES-SMD-0805 EX]
R279  10R  [RES-SMD-0805 EX]
R280  5.1K  [RES-SMD-0805 EX]
R281  5.1K  [RES-SMD-0805 EX]
R282  2K  [RES-SMD-0805 EX]
R283  200R  [RES-SMD-0805 EX]
R284  200R  [RES-SMD-0805 EX]
R285  5.1K  [RES-SMD-0805 EX]
R286  10R  [RES-SMD-0805 EX]
R287  2K  [RES-SMD-0805 EX]
R288  2K  [RES-SMD-0805 EX]
R289  10R  [RES-SMD-0805 EX]
R290  5.1K  [RES-SMD-0805 EX]
R291  10R  [RES-SMD-0805 EX]
R292  5.1K  [RES-SMD-0805 EX]
R293  10R  [RES-SMD-0805 EX]
R294  10R  [RES-SMD-0805 EX]
R295  130R  [RES-SMD-0805 EX]
R296  2K  [RES-SMD-0805 EX]
R297  2K  [RES-SMD-0805 EX]
R298  130R  [RES-SMD-0805 EX]
R299  2K  [RES-SMD-0805 EX]
R300  10R  [RES-SMD-0805 EX]
R301  10R  [RES-SMD-0805 EX]
R302  0R  [RES-SMD-0805 EX]
R303  10R  [RES-SMD-0805 EX]
R304  0R  [RES-SMD-0805 EX]
R305  10R  [RES-SMD-0805 EX]
R306  130R  [RES-SMD-0805 EX]
R307  130R  [RES-SMD-0805 EX]
R308  5.1K  [RES-SMD-0805 EX]
R309  5.1K  [RES-SMD-0805 EX]
R310  510K  [RES-SMD-1206 EX]
R311  510K  [RES-SMD-1206 EX]
R312  510K  [RES-SMD-1206 EX]
R313  510K  [RES-SMD-1206 EX]
R314  430R  [R1206]
R315  430R  [R1206]
R316  5.1K  [RES-SMD-0805 EX]
R317  30K  [RES-SMD-1210 EX]
R318  150K  [RES-SMD-1210 EX]
R319  150K  [RES-SMD-1210 EX]
R320  430R  [R1206]
R321  150K  [RES-SMD-1210 EX]
R322  5.1K  [RES-SMD-0805 EX]
R323  10K  [RES-SMD-0805 EX]
R324  150K  [RES-SMD-1210 EX]
R325  22K  [RES-SMD-0805 EX]
R326  10K  [RES-SMD-0805 EX]
R327  100K  [RES-SMD-1206 EX]
R328  10K  [RES-SMD-0805 EX]
R329  10K  [RES-SMD-0805 EX]
R330  200R  [RES-SMD-0805 EX]
R331  10R  [RES-SMD-0805 EX]
R332  10R  [RES-SMD-0805 EX]
R333  4.7K  [RES-SMD-0805 EX]
R334  5.1K  [RES-SMD-0805 EX]
R335  150K  [RES-SMD-1210 EX]
R336  430R  [R1206]
R337  150K/1206  [RES-SMD-1206 EX]
R338  150K/1206  [RES-SMD-1206 EX]
R339  150K/1206  [RES-SMD-1206 EX]
R340  150K/1206  [RES-SMD-1206 EX]
R341  150K/1206  [RES-SMD-1206 EX]
R342  150K/1206  [RES-SMD-1206 EX]
R343  10R  [RES-SMD-0805 EX]
R344  5.1K  [RES-SMD-0805 EX]
R345  5.1K  [RES-SMD-0805 EX]
R346  10R  [RES-SMD-0805 EX]
R347  5.1K  [RES-SMD-0805 EX]
R348  130R  [RES-SMD-0805 EX]
R349  10K  [RES-SMD-0805 EX]
R350  491K  [RES-SMD-0805 EX]
R351  30K/2010  [RES-SMD-1210 EX]
R352  430R  [R1206]
R353  150K/1206  [RES-SMD-1206 EX]
R354  150K/1206  [RES-SMD-1206 EX]
R355  150K/1206  [RES-SMD-1206 EX]
R356  150K/1206  [RES-SMD-1206 EX]
R357  150K/1206  [RES-SMD-1206 EX]
R358  150K/1206  [RES-SMD-1206 EX]
R359  2R/1206  [RES-SMD-1206 EX]
R360  430R  [R1206]
R361  430R  [R1206]
T3  PM62/EE54  [Transfomer 600W]
T4  EE28  [Transformer EE28]
T5  EE13  [BAX_DVD3]
U11  Current sensor  [Current sensor STB-CAS]
U12  ACPL-W346-000E  [SOIC127P1150X360-6N]
U13  ACPL-W346-000E  [SOIC127P1150X360-6N]
U14  ACPL-W346-000E  [SOIC127P1150X360-6N]
U15  ACPL-W346-000E  [SOIC127P1150X360-6N]
U16  ACPL-W346-000E  [SOIC127P1150X360-6N]
U17  ACPL-W346-000E  [SOIC127P1150X360-6N]
U18  Current sensor  [Current sensor STB-CAS]
U19  ACPL-W346-000E  [SOIC127P1150X360-6N]
U20  ACPL-W346-000E  [SOIC127P1150X360-6N]
U21  ACPL-W346-000E  [SOIC127P1150X360-6N]
U22  ACPL-W346-000E  [SOIC127P1150X360-6N]
U23  ACPL-W346-000E  [SOIC127P1150X360-6N]
U24  ACPL-W346-000E  [SOIC127P1150X360-6N]
U25  ACPL-W346-000E  [SOIC127P1150X360-6N]
U26  ACPL-W346-000E  [SOIC127P1150X360-6N]
U27  ACPL-W346-000E  [SOIC127P1150X360-6N]
U28  ACPL-W346-000E  [SOIC127P1150X360-6N]
U29  4318  [SOP 8]
U30  LM258  [SOIC127P600X175-8N]
U31  617A-3  [OPTO TRANSISTOR_SOP-4]
U32  ACPL-W346-000E  [SOIC127P1150X360-6N]
V3  650V/40A  [TO-247_1]
V4  650V/80A  [TO-247_1]
V5  650V/80A  [TO-247_1]
V6  650V/40A  [TO-247_1]
V7  650V/80A  [TO-247_1]
V8  650V/80A  [TO-247_1]
V9  650V/80A  [TO-247_1]
V10  650V/80A  [TO-247_1]
V11  650V/40A  [TO-3P]
V12  650V/40A  [TO-247_1]

### Ports
+5V (out, see INV.ControlMCU[1D], INV.Main[1D], INV.Main[3A], INV.Main[3D], INV.Main[4A], INV.Power[1D], INV.Power[6C]), +5V (out, see INV.ControlMCU[1D], INV.Main[1D], INV.Main[3A], INV.Main[3D], INV.Power[1D], INV.Power[6C]), +5V (out, see INV.ControlMCU[1D], INV.Main[1D], INV.Main[3A], INV.Main[4A], INV.Power[1D], INV.Power[6C]), +5V (out, see INV.ControlMCU[1D], INV.Main[1D], INV.Main[3D], INV.Main[4A], INV.Power[1D], INV.Power[6C]), +5VF (out, see INV.ControlMCU[1D], INV.ControlMCU[8C], INV.ControlMCU[9C], INV.ControlMCU[11C], INV.Main[1D]), +5VF (out, see INV.ControlMCU[1D], INV.ControlMCU[8C], INV.ControlMCU[9C], INV.ControlMCU[11C], INV.Main[1D], INV.Main[3D]), J1-1 (out, see INV.Main[1D]), J1-2 (out, see INV.Main[1D]), J1-3 (out, see INV.Main[1D]), J1-3 (out, see INV.Main[3A]), J1-4 (out, see INV.Main[1D]), J1-4 (out, see INV.Main[3A]), J1-6 (out, see INV.Main[1D]), J1-6 (out, see INV.Main[3C]), J1-7 (in, see INV.Main[1D]), J1-7 (out, see INV.Main[4B]), J1-8 (in, see INV.Main[1D]), J1-8 (out, see INV.Main[4B]), J1-9 (out, see INV.Main[1D]), J1-9 (out, see INV.Main[3A]), J1-10 (out, see INV.Main[1D]), J1-10 (out, see INV.Main[3A]), J1-11 (out, see INV.Main[1D]), J1-11 (out, see INV.Main[3A]), J1-12 (out, see INV.Main[1D]), J1-12 (out, see INV.Main[3A]), J1-13 (out, see INV.Main[1D]), J1-13 (out, see INV.Main[2B]), J1-14 (out, see INV.Main[1D]), J1-14 (out, see INV.Main[2B]), J1-15 (out, see INV.Main[1D]), J1-15 (out, see INV.Main[2B]), J1-16 (out, see INV.Main[1D]), J1-16 (out, see INV.Main[2B]), J1-19 (out, see INV.Main[1D]), J1-19 (out, see INV.Main[2A]), J1-20 (out, see INV.Main[1D]), J1-20 (out, see INV.Main[2B]), J1-21 (out, see INV.Main[1D]), J1-22 (out, see INV.Main[1D]), J1-23 (out, see INV.Main[1D]), J1-24 (out, see INV.Main[1D]), J1-25 (out, see INV.Main[1D]), J1-25 (out, see INV.Main[2C]), J1-26 (out, see INV.Main[1D]), J1-27 (out, see INV.Main[1D]), J1-27 (out, see INV.Main[4B]), J1-28 (out, see INV.Main[1D]), J1-28 (out, see INV.Main[4C]), J1-29 (out, see INV.Main[1D]), J1-30 (out, see INV.Main[1D]), J1-31 (out, see INV.Main[1D]), J1-32 (out, see INV.Main[1D]), J1-33 (out, see INV.Main[1D]), J1-33 (out, see INV.Main[4A]), J1-34 (out, see INV.Main[1D]), J1-34 (out, see INV.Main[3D]), J1-36 (out, see INV.Main[1D]), J1-36 (out, see INV.Main[4A]), J1-39 (out, see INV.Main[1D]), J1-40 (out, see INV.Main[1D]), J1-40 (out, see INV.Main[2C]), J1-41 (out, see INV.Main[1D]), J1-42 (out, see INV.Main[1D]), J1-43 (out, see INV.Main[1D]), J1-44 (out, see INV.Main[1D]), J1-49 (out, see INV.Main[1D]), J1-50 (out, see INV.Main[1D]), J1_17 (in, see INV.Main[1D]), J1_17 (out, see INV.Main[2D]), J1_18 (in, see INV.Main[1D]), J1_18 (out, see INV.Main[2D]), J2-1 (out, see INV.ControlMCU[2D], INV.Main[1D]), J2-2 (out, see INV.ControlMCU[3D], INV.Main[1D]), J2-3 (out, see INV.ControlMCU[2D], INV.Main[1D]), J2-4 (out, see INV.ControlMCU[3D], INV.Main[1D]), J2-13 (out, see INV.ControlMCU[2D], INV.Main[1D]), J2-14 (out, see INV.ControlMCU[3D], INV.Main[1D]), J2-15 (out, see INV.ControlMCU[2D], INV.Main[1D]), J2-16 (out, see INV.ControlMCU[3D], INV.Main[1D]), J2-17 (out, see INV.ControlMCU[2D], INV.Main[1D]), J2-18 (out, see INV.ControlMCU[3D], INV.Main[1D]), PWM_BOOST_A (in, see INV.ControlMCU[2D], INV.Main[1D]), PWM_BOOST_A (out, see INV.ControlMCU[2D], INV.Main[2B]), PWM_BOOST_B (in, see INV.ControlMCU[3D], INV.Main[1D]), PWM_BOOST_B (out, see INV.ControlMCU[3D], INV.Main[3B]), PWM_DAB_A (in, see INV.ControlMCU[3D], INV.ControlMCU[11D], INV.Main[1B], INV.Main[1D]), PWM_DAB_A (out, see INV.ControlMCU[3D], INV.ControlMCU[11D], INV.Main[1B]), PWM_DAB_B (in, see INV.ControlMCU[2D], INV.ControlMCU[11C], INV.Main[1B], INV.Main[1D]), PWM_DAB_B (out, see INV.ControlMCU[2D], INV.ControlMCU[11C], INV.Main[1B]), PWM_DAB_C (in, see INV.ControlMCU[3D], INV.ControlMCU[11C], INV.Main[1D], INV.Main[2B]), PWM_DAB_C (out, see INV.ControlMCU[3D], INV.ControlMCU[11C], INV.Main[2B]), PWM_DAB_D (in, see INV.ControlMCU[2D], INV.ControlMCU[11C], INV.Main[1D], INV.Main[2B]), PWM_DAB_D (out, see INV.ControlMCU[2D], INV.ControlMCU[11C], INV.Main[2B]), PWM_HERIC_A (in, see INV.ControlMCU[2D], INV.ControlMCU[9C], INV.Main[1D]), PWM_HERIC_A (out, see INV.ControlMCU[2D], INV.ControlMCU[9C], INV.Main[4B]), PWM_HERIC_B (in, see INV.ControlMCU[3D], INV.ControlMCU[9C], INV.Main[1D]), PWM_HERIC_B (out, see INV.ControlMCU[3D], INV.ControlMCU[9C], INV.Main[4B]), PWM_MPPT (in, see INV.ControlMCU[3D], INV.Main[1D]), PWM_MPPT (out, see INV.ControlMCU[3D], INV.Main[4D]), PWM_Sine_A (in, see INV.ControlMCU[2D], INV.ControlMCU[9C], INV.Main[1D], INV.Main[3B]), PWM_Sine_A (out, see INV.ControlMCU[2D], INV.ControlMCU[9C], INV.Main[3B]), PWM_Sine_B (in, see INV.ControlMCU[3D], INV.ControlMCU[9D], INV.Main[1D], INV.Main[3B]), PWM_Sine_B (out, see INV.ControlMCU[3D], INV.ControlMCU[9D], INV.Main[3B])

### Nets
-5V_DR1: C122.1 C143.2 C171.2 C195.1 C238.2 C239.2 C244.1 C245.1 C246.1 R320.2 T4.16 U13.4(VEE) U26.4(VEE)
-5V_DR2: C123.1 C145.2 C147.1 C156.2 C209.2 C210.2 C215.1 C216.1 C217.1 R314.2 T4.22 U14.4(VEE) U20.4(VEE)
-5V_DR3: C134.2 C154.1 C173.1 C174.1 C196.2 C197.2 C218.2 C219.2 C228.1 C229.1 C230.1 C247.1 C277.2 R315.2 T4.19 U19.4(VEE) U24.4(VEE) U25.4(VEE) U32.4(VEE)
-5V_DR4: C135.1 C136.1 C259.1 C260.1 C261.1 U21.4(VEE)
G_DR1: *24.1(A) C124.1 C133.1 C143.1 C185.2 C190.2 C195.2 C240.2 C241.2 C242.2 C243.2 C244.2 C245.2 C246.2 L13.1 R202.2 R285.2 R313.2 R320.1 V4.3(E) V8.3(E) V9.2(C)
G_DR2: *22.1(A) C125.1 C137.1 C145.1 C147.2 C151.2 C155.2 C211.2 C212.2 C213.2 C214.2 C215.2 C216.2 C217.2 L13.2 R174.2 R205.2 R235.1 R314.1 V5.3(E) V7.3(E) V10.2(C)
G_DR4: *25.1(A) C127.2 C135.2 C146.1 C253.2 C254.2 C255.2 C256.2 C259.2 C260.2 C261.2 L12.2 R185.1 R336.1 V3.3(E) V6.2(C)
G_LLC_A: *30.1(A) C112.1 C113.1 C141.1 C148.2 C149.1 C152.1 C157.2 C158.2 C159.2 C160.2 C302.2 C303.2 C304.2 C305.2 C306.2 C307.2 C308.2 QH2.3(E) QH4.2(C) R231.2 R361.1
G_LLC_B: *28.1(A) C104.1 C105.1 C131.1 C140.2 C142.1 C150.1 C292.2 C293.2 C294.2 C295.2 C297.2 C298.2 C299.2 QH1.3(E) QH3.2(C) R217.2 R360.1 T3.4
G_NEG: C94.1 C95.1 C96.1 C97.2 C98.1 C99.1 C106.2 C248.2 C249.1 C258.1 CE1.2 CE2.2 FB2.2 J7.35 J7.37 J7.38 J7.45 J7.46 J8.14 NTC1.1 NTC2.1 R334.2 U11.13(Gnd) U18.13(Gnd) U31.3
GND: FB2.1 J8.19 J9.5 J9.6 J9.11 J9.12 J9.19 J9.20 J9.29 J9.30 R213.2 R216.1 R218.1 R221.2 R224.2 R226.2 R229.2 R240.2 R250.1 R276.2 R277.2 R295.1 R298.1 R299.1 R306.2 R307.2 R348.2
GND_BAT: BT1.8 C161.1 C162.1 C163.1 C164.1 C165.1 C166.1 C167.1 C168.1 C186.1 C188.1 C231.2 C232.2 C233.1 C234.1 C235.2 C257.2 C267.1 C268.1 C269.1 C270.1 C271.1 C272.1 C273.1 C274.1 C275.1 C276.1 C288.2 C289.2 L16.4 P2.3 P2.4 Q16.2(C) Q17.2(C) QL3.3(S) QL4.3(S) R280.2 R281.2 R333.1 R351.2 R353.2 R359.2 T5.8 U22.4(VEE) U23.4(VEE) U29.2(InA-) U29.3(InA+) U29.6(InB-) U29.7(OutPutB) U30.3(+INA) U30.4(GND)
LLC_A_-5V: C109.1 C110.1 C111.1 C149.2 C152.2 C300.2 C301.2 C306.1 C307.1 C308.1 Q13.3(C) R361.2 T4.1 U17.4(VEE)
LLC_B_-5V: C101.1 C102.1 C103.1 C142.2 C150.2 C290.2 C291.2 C297.1 C298.1 C299.1 Q10.3(C) R360.2 T4.7 U12.4(VEE)
LLC_CD_-5V: C175.1 C176.1 C177.1 C180.1 C181.1 C182.1 C202.2 C203.2 C204.2 C205.2 C278.2 C279.2 C285.1 C286.1 C287.1 Q20.3(C) Q21.3(C) R352.2 T4.10 U27.4(VEE) U28.4(VEE)
NEG: *23.1(A) *27.1(A) C100.2 C107.2 C108.2 C144.2 C153.2 C154.2 C178.1 C179.1 C183.1 C184.1 C187.1 C189.1 C191.1 C192.1 C196.1 C197.1 C198.1 C199.1 C200.2 C201.2 C202.1 C203.1 C204.1 C205.1 C207.2 C208.1 C220.2 C221.2 C222.2 C223.2 C228.2 C229.2 C230.2 C236.2 C237.2 C250.1 C263.1 C264.1 C277.1 C280.2 C281.2 C282.2 C283.2 C285.2 C286.2 C287.2 C296.1 LED1.2 PV_+4.1 QH3.3(E) QH4.3(E) R161.1 R168.2 R180.2 R234.2 R290.2 R292.1 R308.2 R309.2 R315.1 R335.2 R344.2 R347.2 R352.1 V6.3(E) V9.3(E) V10.3(E) V11.3(E) V12.3(E)
PE: C126.1
VS1: C118.1 C119.1 C120.1 C121.1 C139.1 C224.1 C225.2 Q12.2(C) QL2.3(S) QL3.2(D) R228.2 T3.1 T5.6 U16.4(VEE)
VS2: BT1.6 C114.1 C115.1 C116.1 C117.1 C138.1 C226.2 C227.1 Q11.2(C) QL1.3(S) QL4.2(D) R227.2 T3.2 U15.4(VEE)
+5V: C95.2 C96.2 C99.2 C249.2 CE1.1 CE2.1 FB1.1 J8.15 J8.16 R323.1 R325.2 U11.14(Vcc) U18.14(Vcc) ; port +5V
+15V_DAB_A: C118.2 C119.2 C120.2 C121.2 C224.2 C225.1 D33.2(K) R183.1 R184.1 U16.6(VCC) ; off-sheet +15V_DAB_A
+15V_DAB_B: C114.2 C115.2 C116.2 C117.2 C226.1 C227.2 D34.2(K) R181.1 R182.1 U15.6(VCC) ; off-sheet +15V_DAB_B
+15V_DAB_C: C161.2 C162.2 C163.2 C164.2 C231.1 C232.1 C233.2 D36.1(A1) D37.2(K) R245.1 R246.1 R322.2 U22.6(VCC) U30.8(V+) ; off-sheet +15V_DAB_C
+15V_DAB_D: C165.2 C166.2 C167.2 C168.2 C234.2 C235.1 D38.2(K) R247.1 R248.1 U23.6(VCC) ; off-sheet +15V_DAB_D
+15V_DR1: *24.2(K) C122.2 C124.2 C171.1 C185.1 C238.1 C239.1 C240.1 C241.1 C242.1 C243.1 D39.2(K) U13.6(VCC) U26.6(VCC) ; off-sheet +15V_DR1
+15V_DR2: *22.2(K) C123.2 C125.2 C155.1 C156.1 C209.1 C210.1 C211.1 C212.1 C213.1 C214.1 D30.2(K) U14.6(VCC) U20.6(VCC) ; off-sheet +15V_DR2
+15V_DR3: *23.2(K) C134.1 C144.1 C173.2 C174.2 C187.2 C189.2 C218.1 C219.1 C220.1 C221.1 C222.1 C223.1 C247.2 C250.2 D32.2(K) U19.6(VCC) U24.6(VCC) U25.6(VCC) U32.6(VCC) ; off-sheet +15V_DR3
+15V_DR4: *25.2(K) C136.2 C146.2 C251.1 C252.1 C253.1 C254.1 C255.1 C256.1 D40.2(K) U21.6(VCC) ; off-sheet +15V_DR4
+15V_LLC_A: *30.2(K) C109.2 C110.2 C111.2 C112.2 C113.2 C300.1 C301.1 C302.1 C303.1 C304.1 C305.1 D44.2(K) R175.1 R176.1 U17.6(VCC) ; off-sheet +15V_LLC_A
+15V_LLC_B: *28.2(K) C101.2 C102.2 C103.2 C104.2 C105.2 C290.1 C291.1 C292.1 C293.1 C294.1 C295.1 D43.2(K) R169.1 R170.1 U12.6(VCC) ; off-sheet +15V_LLC_B
+15V_LLC_CD: *27.2(K) C175.2 C176.2 C177.2 C178.2 C179.2 C180.2 C181.2 C182.2 C183.2 C184.2 C278.1 C279.1 C280.1 C281.1 C282.1 C283.1 D42.2(K) R266.1 R267.1 R268.1 R269.1 U27.6(VCC) U28.6(VCC) ; off-sheet +15V_LLC_CD
BAT +48: C267.2 C268.2 C269.2 C270.2 C271.2 C272.2 C273.2 C274.2 C275.2 C276.2 L16.3 P2.1 P2.2 QL1.2(D) QL2.2(D) R317.2 R329.1 R337.2 R351.1 ; off-sheet BAT +48
BUS +: C107.1 C108.1 C236.1 C237.1 D35.3(K) PV_+2.1 R155.1 R318.1 V3.2(C) V4.2(C) V5.2(C) ; off-sheet BUS +
Net2_1: 2.1 C262.2 C265.2 C266.2 L16.2
Net3_1: 3.1 C265.1 C266.1 C284.1 L16.1
Net*19_1: *19.1 C207.1
Net*20_1: *20.1 C206.1
Net*21_1: *21.1 C208.2
Net*26_1: *26.1 C262.1 C284.2
Net*29_1: *29.1 C288.1 C289.1
NetBT1_1: BT1.1 J6.1 T4.4 T5.1
NetBT1_2: BT1.2 BT1.3
NetBT1_4: BT1.4 D31.2(K)
NetBT1_5: BT1.5 D34.1(A)
NetBT1_7: BT1.7 D38.1(A)
NetC94_2: C94.2 R150.1 U11.12(Vout)
NetC97_1: C97.1 R149.1 U11.11(Vfef)
NetC98_2: C98.2 R160.1 U18.12(Vout)
NetC100_1: C100.1 QH1.2(C) QH2.2(C) R154.2 R165.1 U11.1(In)
NetC106_1: C106.1 R159.1 U18.11(Vfef)
NetC126_2: C126.2 C169.2 H3.1 R244.2 U18.2(Out)
NetC127_1: C127.1 R199.1
NetC128_1: C128.1 R195.2 R213.1 U12.3(CATHODE)
NetC128_2: C128.2 R186.2 R195.1 U12.1(ANODE)
NetC129_1: C129.1 R206.2 R221.1 U15.3(CATHODE)
NetC129_2: C129.2 R193.1 R206.1 U15.1(ANODE)
NetC130_1: C130.1 R207.2 R224.1 U16.3(CATHODE)
NetC130_2: C130.2 R196.1 R207.1 U16.1(ANODE)
NetC131_2: C131.2 Q6.1(B) Q10.1(B) R189.2
NetC132_1: C132.1 R211.2 R226.1 U17.3(CATHODE)
NetC132_2: C132.2 R191.2 R211.1 U17.1(ANODE)
NetC133_2: C133.2 R201.2
NetC137_2: C137.2 R204.2
NetC138_2: C138.2 Q7.1(B) Q11.1(B) R194.1
NetC139_2: C139.2 Q8.1(B) Q12.1(B) R197.1
NetC140_1: C140.1 R209.2
NetC141_2: C141.2 Q9.1(B) Q13.1(B)
NetC148_1: C148.1 R222.2
NetC151_1: C151.1 R236.2
NetC153_1: C153.1 R233.1
NetC157_1: C157.1 C158.1 C159.1 C160.1 T3.3
NetC169_1: C169.1 C206.2 H4.1 L13.4 R256.2
NetC170_1: C170.1 R262.2 R276.1 U22.3(CATHODE)
NetC170_2: C170.2 R258.1 R262.1 U22.1(ANODE)
NetC172_1: C172.1 R263.2 R277.1 U23.3(CATHODE)
NetC172_2: C172.2 R260.1 R263.1 U23.1(ANODE)
NetC186_2: C186.2 Q15.1(B) Q17.1(B) R261.1
NetC188_2: C188.2 Q14.1(B) Q16.1(B) R259.1
NetC190_1: C190.1 R286.1
NetC191_2: C191.2 R289.1
NetC192_2: C192.2 R291.2
NetC193_1: C193.1 R296.2 R306.1 U27.3(CATHODE)
NetC193_2: C193.2 R283.2 R296.1 U27.1(ANODE)
NetC194_1: C194.1 R297.2 R307.1 U28.3(CATHODE)
NetC194_2: C194.2 R284.2 R297.1 U28.1(ANODE)
NetC198_2: C198.2 Q18.1(B) Q20.1(B) R293.2
NetC199_2: C199.2 Q19.1(B) Q21.1(B) R294.2
NetC200_1: C200.1 R302.2
NetC201_1: C201.1 R304.2
NetC248_1: C248.1 J7.6 R323.2 U31.4 ; port J1-6
NetC251_2: C251.2 C252.2 R336.2 T4.13
NetC257_1: C257.1 R326.1 R327.2 R333.2
NetC258_2: C258.2 J7.34 R325.1 R334.1 ; port J1-34
NetC263_2: C263.2 R343.1
NetC264_2: C264.2 R346.2
NetC296_2: C296.2 R359.1
NetC317_2: FB1.2 J7.47 J7.48 ; port +5VF
NetD28_1: D28.1(A) D29.1(A1) D29.3(A2) D31.1(A) J6.2
NetD28_2: D28.2(K) T5.4
NetD29_2: D29.2(K) T4.5
NetD30_1: D30.1(A) T4.21
NetD32_1: D32.1(A) T4.18
NetD33_1: D33.1(A) T5.5
NetD35_1: D35.1(A1) D35.2(A2) L15.2 V11.2(C) V12.2(C)
NetD36_2: D36.2(A2) R317.1
NetD36_3: D36.3(K) R316.1
NetD37_1: D37.1(A) T5.7
NetD39_1: D39.1(A) T4.15
NetD40_1: D40.1(A) T4.12
NetD41_1: D41.1(A1) D41.2(A2) R350.1
NetD41_3: D41.3(K) U30.7(OUTB) U31.2
NetD42_1: D42.1(A) T4.11
NetD43_1: D43.1(A) T4.8
NetD44_1: D44.1(A) T4.2
NetJ7_1: J7.1 J8.1 ; port J1-1
NetJ7_2: J7.2 J8.2 ; port J1-2
NetJ7_3: J7.3 R158.2 ; port J1-3
NetJ7_4: J7.4 R164.2 ; port J1-4
NetJ7_7: J7.7 R253.1 ; port J1-8
NetJ7_8: J7.8 R241.1 ; port J1-7
NetJ7_9: J7.9 J7.10 R149.2 ; port J1-9, port J1-10
NetJ7_11: J7.11 J7.12 R150.2 ; port J1-11, port J1-12
NetJ7_13: J7.13 J7.15 L14.3 R249.1 R257.1 ; port J1-13, port J1-15
NetJ7_14: J7.14 J7.16 L14.4 R249.2 R257.2 ; port J1-14, port J1-16
NetJ7_17: J7.17 R342.1 ; port J1_17
NetJ7_18: J7.18 R358.1 ; port J1_18
NetJ7_19: J7.19 R151.1 ; port J1-19
NetJ7_20: J7.20 R177.1 ; port J1-20
NetJ7_21: J7.21 J8.4 ; port J1-21
NetJ7_22: J7.22 J8.3 ; port J1-22
NetJ7_23: J7.23 J8.10 ; port J1-23
NetJ7_24: J7.24 J8.9 ; port J1-24
NetJ7_25: J7.25 NTC1.2 ; port J1-25
NetJ7_26: J7.26 J8.11 ; port J1-26
NetJ7_27: J7.27 R171.1 ; port J1-27
NetJ7_28: J7.28 R310.1 ; port J1-28
NetJ7_29: J7.29 J8.6 ; port J1-29
NetJ7_30: J7.30 J8.5 ; port J1-30
NetJ7_31: J7.31 J8.7 ; port J1-31
NetJ7_32: J7.32 J8.8 ; port J1-32
NetJ7_33: J7.33 R159.2 ; port J1-33
NetJ7_36: J7.36 R160.2 ; port J1-36
NetJ7_39: J7.39 J8.12 ; port J1-39
NetJ7_40: J7.40 NTC2.2 ; port J1-40
NetJ7_41: J7.41 J8.22 ; port J1-41
NetJ7_42: J7.42 J8.24 ; port J1-42
NetJ7_43: J7.43 J7.44 J8.13 ; port J1-43, port J1-44
NetJ7_49: J7.49 J7.50 J8.17 ; port J1-49, port J1-50
NetJ8_18: J8.18 J9.4 ; port J2-4
NetJ8_20: J8.20 J9.3 ; port J2-3
NetJ8_21: J8.21 J9.1 ; port J2-1
NetJ8_23: J8.23 J9.14 ; port J2-14
NetJ8_25: J8.25 J9.13 ; port J2-13
NetJ8_26: J8.26 J9.16 ; port J2-16
NetJ8_27: J8.27 J9.15 ; port J2-15
NetJ8_28: J8.28 J9.2 ; port J2-2
NetJ8_29: J8.29 J9.18 ; port J2-18
NetJ8_30: J8.30 J9.17 ; port J2-17
NetJ9_8: J9.8 R330.1 ; port PWM_MPPT
NetJ9_9: J9.9 R225.1 ; port PWM_BOOST_A
NetJ9_10: J9.10 R252.2 ; port PWM_BOOST_B
NetJ9_21: J9.21 R193.2 R258.2 ; port PWM_DAB_B
NetJ9_22: J9.22 R196.2 R260.2 ; port PWM_DAB_A
NetJ9_23: J9.23 R191.1 R283.1 ; port PWM_DAB_D
NetJ9_24: J9.24 R186.1 R284.1 ; port PWM_DAB_C
NetJ9_25: J9.25 R187.2 R271.2 ; port PWM_Sine_A
NetJ9_26: J9.26 R275.1 ; port PWM_HERIC_B
NetJ9_27: J9.27 R239.1 ; port PWM_HERIC_A
NetJ9_28: J9.28 R188.2 R270.2 ; port PWM_Sine_B
NetL12_1: L12.1 U11.2(Out)
NetL13_3: L13.3 U18.1(In)
NetL15_1: L15.1 PV_+3.1
NetLED1_1: LED1.1 R324.2 R335.1
NetQ6_2: Q6.2(E) Q10.2(E) R198.1 R209.1 R210.1
NetQ6_3: Q6.3(C) R169.2 R170.2
NetQ7_2: Q7.2(C) R181.2 R182.2
NetQ7_3: Q7.3(E) Q11.3(E) R208.2 R219.2
NetQ8_2: Q8.2(C) R183.2 R184.2
NetQ8_3: Q8.3(E) Q12.3(E) R212.2 R220.2
NetQ9_2: Q9.2(E) Q13.2(E) R214.1 R222.1 R223.1
NetQ9_3: Q9.3(C) R175.2 R176.2
NetQ14_2: Q14.2(C) R245.2 R246.2
NetQ14_3: Q14.3(E) Q16.3(E) R264.2 R272.2
NetQ15_2: Q15.2(C) R247.2 R248.2
NetQ15_3: Q15.3(E) Q17.3(E) R265.2 R273.2
NetQ18_2: Q18.2(E) Q20.2(E) R300.1 R302.1 R303.1
NetQ18_3: Q18.3(C) R266.2 R267.2
NetQ19_2: Q19.2(E) Q21.2(E) R301.1 R304.1 R305.1
NetQ19_3: Q19.3(C) R268.2 R269.2
NetQH1_1: QH1.1(G) R198.2 R210.2 R217.1
NetQH2_1: QH2.1(G) R214.2 R223.2 R231.1
NetQH3_1: QH3.1(G) R300.2 R303.2 R308.1
NetQH4_1: QH4.1(G) R301.2 R305.2 R309.1
NetQL1_1: QL1.1(G) R208.1 R219.1 R227.1
NetQL2_1: QL2.1(G) R212.1 R220.1 R228.1
NetQL3_1: QL3.1(G) R264.1 R272.1 R280.1
NetQL4_1: QL4.1(G) R265.1 R273.1 R281.1
NetR151_2: R151.2 R152.1
NetR152_2: R152.2 R153.1
NetR153_2: R153.2 R154.1
NetR155_2: R155.2 R156.1
NetR156_2: R156.2 R157.1
NetR157_2: R157.2 R158.1
NetR161_2: R161.2 R162.1
NetR162_2: R162.2 R163.1
NetR163_2: R163.2 R164.1
NetR165_2: R165.2 R166.1
NetR166_2: R166.2 R167.1
NetR167_2: R167.2 R168.1
NetR171_2: R171.2 R172.1
NetR172_2: R172.2 R173.1
NetR173_2: R173.2 R174.1
NetR177_2: R177.2 R178.1
NetR178_2: R178.2 R179.1
NetR179_2: R179.2 R180.1
NetR185_2: R185.2 R199.2 R215.2 V3.1(G)
NetR187_1: R187.1 R203.2 U14.1(ANODE)
NetR188_1: R188.1 R200.2 U13.1(ANODE)
NetR189_1: R189.1 U12.5(VOUT)
NetR190_1: R190.1 R201.1 R202.1 V4.1(G)
NetR190_2: R190.2 U13.5(VOUT)
NetR192_1: R192.1 R204.1 R205.1 V5.1(G)
NetR192_2: R192.2 U14.5(VOUT)
NetR194_2: R194.2 U15.5(VOUT)
NetR197_2: R197.2 U16.5(VOUT)
NetR200_1: R200.1 R216.2 U13.3(CATHODE)
NetR203_1: R203.1 R218.2 U14.3(CATHODE)
NetR215_1: R215.1 U21.5(VOUT)
NetR225_2: R225.2 R232.1 U19.1(ANODE)
NetR229_1: R229.1 R237.2 U20.3(CATHODE)
NetR230_1: R230.1 U19.5(VOUT)
NetR230_2: R230.2 R233.2 R234.1 V6.1(G)
NetR232_2: R232.2 R240.1 U19.3(CATHODE)
NetR235_2: R235.2 R236.1 R238.2 V7.1(G)
NetR237_1: R237.1 R239.2 U20.1(ANODE)
NetR238_1: R238.1 U20.5(VOUT)
NetR241_2: R241.2 R242.1
NetR242_2: R242.2 R243.1
NetR243_2: R243.2 R244.1
NetR250_2: R250.2 R251.1 U21.3(CATHODE)
NetR251_2: R251.2 R252.1 U21.1(ANODE)
NetR253_2: R253.2 R254.1
NetR254_2: R254.2 R255.1
NetR255_2: R255.2 R256.1
NetR259_2: R259.2 U22.5(VOUT)
NetR261_2: R261.2 U23.5(VOUT)
NetR270_1: R270.1 R288.2 U24.1(ANODE)
NetR271_1: R271.1 R287.2 U25.1(ANODE)
NetR274_1: R274.1 U26.5(VOUT)
NetR274_2: R274.2 R285.1 R286.2 V8.1(G)
NetR275_2: R275.2 R282.2 U26.1(ANODE)
NetR278_1: R278.1 R289.2 R290.1 V9.1(G)
NetR278_2: R278.2 U25.5(VOUT)
NetR279_1: R279.1 R291.1 R292.2 V10.1(G)
NetR279_2: R279.2 U24.5(VOUT)
NetR282_1: R282.1 R295.2 U26.3(CATHODE)
NetR287_1: R287.1 R298.2 U25.3(CATHODE)
NetR288_1: R288.1 R299.2 U24.3(CATHODE)
NetR293_1: R293.1 U27.5(VOUT)
NetR294_1: R294.1 U28.5(VOUT)
NetR310_2: R310.2 R311.1
NetR311_2: R311.2 R312.1
NetR312_2: R312.2 R313.1
NetR316_2: R316.2 R349.2 U29.1(OutPutA) U29.8(Vcc)
NetR318_2: R318.2 R319.1
NetR319_2: R319.2 R321.1
NetR321_2: R321.2 R324.1
NetR322_1: R322.1 U31.1
NetR326_2: R326.2 U30.6(-INB)
NetR327_1: R327.1 R328.2
NetR328_1: R328.1 R329.2
NetR330_2: R330.2 R345.1 U32.1(ANODE)
NetR331_1: R331.1 R332.1 U32.5(VOUT)
NetR331_2: R331.2 R343.2 R344.1 V11.1(G)
NetR332_2: R332.2 R346.1 R347.1 V12.1(G)
NetR337_1: R337.1 R338.2
NetR338_1: R338.1 R339.2
NetR339_1: R339.1 R340.2
NetR340_1: R340.1 R341.2
NetR341_1: R341.1 R342.2
NetR345_2: R345.2 R348.1 U32.3(CATHODE)
NetR349_1: R349.1 R350.2 U30.5(+INB)
NetR353_1: R353.1 R354.2
NetR354_1: R354.1 R355.2
NetR355_1: R355.1 R356.2
NetR356_1: R356.1 R357.2
NetR357_1: R357.1 R358.2
NetT5_2: T5.2 T5.3
NetU30_1: U30.1(OUTA) U30.2(-INA)
NetV7_2: V7.2(C) V8.2(C)

Not connected (* = marked no-connect by the designer): J7 5*; J9 7; L14 1 2; R148 1 2; U17 5(VOUT); U29 4(VEE/Gnd) 5(InB+)

### Layout directives
mark named ?: NetR316_2, NetU29_4, NetU29_5
mark named Check: NetJ9_7

### Notes on the sheet
- Title:
- NOTE:
- Size:
- Date:
- Uplate:
- Number:
- Time:
- Revision:
- (in symbol LM358N/NOPB) A; B

### Library data of the parts
2 3 *19-*21 *26 *29 H3 H4 PV_+2-PV_+4 = Copper
BT1 T5 = Tranfomer EE13: Designed by: VanDungEvn; Value: BAX
C94-C99 C101-C106 C109-C125 C127-C139 C141-C156 C161-C168 C170-C199 C202-C205 C224 C227 C232-C234 C247-C250 C257 C258 C263 C264 C277 = CAP-SMD: Value: 33pF
C100 = CAP C3D 35x46x35mm: capacitor E256238; MP: ECWFG2J475KA; MF: Panasonic; Value: *; Price: None; Package: MOLDED-2 Panasonic; Availability: In Stock; Check_prices: https://www.snapeda.com/parts/ECWFG2J475KA/Panasonic/view-part/?ref=eda; SnapEDA_Link: https://www.snapeda.com/parts/ECWFG2J475KA/Panasonic/view-part/?ref=snap
C107 C108 C225 C226 C231 C235-C237 = Cap - 10x18 - N: Cắm; Don_Vi: Con; So_Chan: 2; Ten_Linh_Kien: Tụ Hóa 220uF 10V 6x11MM; Ma_Hang: MH004510; Chung_Loai: Cắm; Kieu_Chan: *
C126 C206 C296 = CAP N5-1n/500V: Metallized Polypropylene Film Capacitor; MP: ECWFG2J475KA; MF: Panasonic; Value: *; Price: None; Package: MOLDED-2 Panasonic; Availability: In Stock; Check_prices: https://www.snapeda.com/parts/ECWFG2J475KA/Panasonic/view-part/?ref=eda; SnapEDA_Link: https://www.snapeda.com/parts/ECWFG2J475KA/Panasonic/view-part/?ref=snap
C140 C200 C201 C209 C211-C218 C220-C223 C228-C230 C238 C240-C246 C251 C253-C256 C259-C261 C278 C280-C283 C285-C287 C290 C292-C295 C297-C300 C302-C308 = Tu dan gom: Tu khong phan cuc; Value: 0.47uF
C157-C160 = ECWFG2J475KA: Metallized Polypropylene Film Capacitor; MF: Panasonic; Value: *; Price: None; Package: MOLDED-2 Panasonic; MP: ECWFG2J475KA; Availability: In Stock; Check_prices: https://www.snapeda.com/parts/ECWFG2J475KA/Panasonic/view-part/?ref=eda; SnapEDA_Link: https://www.snapeda.com/parts/ECWFG2J475KA/Panasonic/view-part/?ref=snap
C169 = CAP X2 B32824: CAP X2 B32924; MP: ECWFG2J475KA; MF: Panasonic; Value: *; Price: None; Package: MOLDED-2 Panasonic; Availability: In Stock; Check_prices: https://www.snapeda.com/parts/ECWFG2J475KA/Panasonic/view-part/?ref=eda; SnapEDA_Link: https://www.snapeda.com/parts/ECWFG2J475KA/Panasonic/view-part/?ref=snap
C207 C208 = Cap an toan: Metallized Polypropylene Film Capacitor; MP: ECWFG2J475KA; MF: Panasonic; Value: *; Price: None; Package: MOLDED-2 Panasonic; Availability: In Stock; Check_prices: https://www.snapeda.com/parts/ECWFG2J475KA/Panasonic/view-part/?ref=eda; SnapEDA_Link: https://www.snapeda.com/parts/ECWFG2J475KA/Panasonic/view-part/?ref=snap
C210 C219 C239 C252 C279 C291 C301 = Cap - 10x18 - N: Cắm 100uF 25V; Don_Vi: Con; So_Chan: 2; Ten_Linh_Kien: Tụ Hóa 220uF 10V 6x11MM; Ma_Hang: MH004510; Chung_Loai: Cắm; Kieu_Chan: *
C262 C284 C288 C289 = CC0603JRNPO9BN910: CAP CER 91PF 50V 5% COG/NPO 0603; Solder: SMT; CompanyID: VT-01341; Value: 91pF/50V; MPN: CC0603JRNPO9BN910; Category: CAPACITOR; PinCount: 2
C265-C276 = CC0603JRNPO9BN910: Cap Film; Solder: SMT; CompanyID: VT-01341; Value: 91pF/50V; MPN: CC0603JRNPO9BN910; Category: CAPACITOR; PinCount: 2
CE1 CE2 = CAP-ALU-DIP: 6x14mm; Published: 8-Jun-2000; LatestRevisionDate: 17-Jul-2002; LatestRevisionNote: Re-released for DXP Platform.; PackageReference: POLAR0.8; Publisher: Altium Limited
D28 D30-D34 D37-D40 D42-D44 = DIODE: Diode 600V 2A thay the ES2J; Value: 1N4007
D29 = Diode Double: 200V/5A TO-252 MURD520; MP: STTH2003CG-TR; Package: None; Price: None; Value: *; Availability: Unavailable
D35 = Diode Double: 600V/30A STTH30AC06 TO3P-3L; MP: STTH2003CG-TR; Package: None; Price: None; Value: *; Availability: Unavailable
D36 = Diode Double: MP: STTH2003CG-TR; Package: None; Price: None; Value: *; Availability: Unavailable
D41 = Diode Double: STTH2003 Series Dual 10 A 1 V 35 ns Secondary Rectifier Surface Mount - D2PAK; MP: STTH2003CG-TR; Package: None; Price: None; Value: *; Availability: Unavailable
FB1 FB2 = RC0603FR-0775RL: RES SMD 75 OHM 1% 1/10W 0603; Solder: SMT; Value: 75R; MPN: RC0603FR-0775RL; Category: RESISTOR; PinCount: 2
J6 NTC1 NTC2 = Jump2
J7 = Header 25x2: Header, 25x2-Pin 2.5mm; LatestRevisionDate: 17-Jul-2002; LatestRevisionNote: Re-released for DXP Platform.; Publisher: Altium Limited
J8 J9 = Header 15x2: Header, 15x2-Pin 2.5mm; LatestRevisionDate: 17-Jul-2002; LatestRevisionNote: Re-released for DXP Platform.; Publisher: Altium Limited
L12 = LBOSHOG-V1: Cuận cảm bộ sạc PWM Hybrid; Value: Loc 220; Designed by: VanDungEvn
L13 = LSINEOG-V1: Cuận cảm bộ sạc PWM Hybrid; Value: Loc 220; Designed by: VanDungEvn
L14 = Bien ap dong: Biến áp đo dòng; Value: Loc 220; Designed by: VanDungEvn
L15 = LBOSPVOG-V1: Cuận cảm bộ sạc PWM Hybrid; Value: Loc 220; Designed by: VanDungEvn
L16 = LBATOG-V1: Cuận cảm bộ sạc PWM Hybrid; Value: Loc 220; Designed by: VanDungEvn
LED1 = LED1-SMD: Value: LED 3 - 5 ly 2 Colour
P2 = Header 4P 2.54 Duc Thang: Cắm; Ten_Linh_Kien: Header 4P XH2.54-4P Đực Thẳng; Don_Vi: Con; Ma_Hang: MH001285; Chung_Loai: Cắm
Q6 Q9 Q18 Q19 = D882M: NPN 40V/2A PBSS4240T
Q7 Q8 Q14 Q15 = D882M: thay the D882
Q10 Q13 Q20 Q21 = B772M-PNP: PNP 40V/2A PBSS5240T; Value: C9015
Q11 Q12 Q16 Q17 = B772M-PNP: thay the B772; Value: C9015
QH1-QH4 = FGA25N120ANTD: IGBT NPT IKW50N65EH5 thay the xang IKW50N65ET7; MF: ON Semiconductor; Value: *; Digi-Key_Purchase_URL: https://www.digikey.in/product-detail/en/on-semiconductor/FGA25N120ANTDTU/FGA25N120ANTDTU-ND/820640?utm_source=snapeda&utm_medium=aggregator&utm_campaign=symbol; MP: FGA25N120ANTD; Package: TO-3 Fairchild Semiconductor; SnapEDA_Link: https://www.snapeda.com/parts/FGA25N120ANTD/ON%20Semiconductor/view-part/202622/?ref=snap; Digi-Key_Part_Number: FGA25N120ANTDTU-ND
QL1-QL4 = MOSFET IRF N: N-channel mosfet IRFP4468PBF; Value: IRF840
R148-R150 R159 R160 R169 R170 R175 R176 R181-R240 R245-R248 R250-R252 R258-R309 R316 R322 R323 R325-R334 R343-R350 = Res-SMD: 0805; Manufacturer: Generic Components; Class: Passive; Published: 08/06/2000; Publisher: Altium Hobart Technology Centre
R151-R158 R161-R168 R171-R174 R177-R180 R241-R244 R253-R256 R310-R313 = Res-SMD: 1206; Manufacturer: Generic Components; Class: Passive; Published: 08/06/2000; Publisher: Altium Hobart Technology Centre
R249 R257 R314 R315 R320 R336-R342 R351-R361 = R dan: Resistor 0805; Manufacturer: Generic Components; Class: Passive; Published: 08/06/2000; Publisher: Altium Hobart Technology Centre
R317-R319 R321 R324 R335 = Res-SMD: 1210 EX; Manufacturer: Generic Components; Class: Passive; Published: 08/06/2000; Publisher: Altium Hobart Technology Centre
T3 = Transfomer PM62: Biến áp xung 5KW PM62/44; MP: 14A-10R-10; Package: None; Price: None; Value: *; Availability: Unavailable
T4 = Transfomer EE28: MP: 14A-10R-10; Package: None; Price: None; Value: *; Availability: Unavailable
U11 U18 = Current sensor: Bien dong sinomags STB-CAS/R; Value: Loc 220; Designed by: VanDungEvn
U12-U17 U19-U28 U32 = ACPL-W346-000E: 2.5A Gate Driver Optical Coupling 5000Vrms 1 Channel 6-SO Stretched; MF: Broadcom Limited; Package: SOIC-6 Broadcom; Availability: Unavailable; MP: ACPL-W346-000E; Value: *; SnapEDA_Link: https://www.snapeda.com/parts/ACPL-W346-000E/Broadcom%20Limited/view-part/2767622/?ref=snap; Price: None
U29 = LM358 SOP8: Dán; Ma_Hang: MH000609; Don_Vi: Con; Ten_Linh_Kien: LM358 SOP8; Kieu_Chan: *; Ghi_Chu: *; Chung_Loai: Dán
U30 = LM358N/NOPB: MF: Texas Instruments; SnapEDA_Link: https://www.snapeda.com/parts/LM358N/NOPB/Texas+Instruments/view-part/?ref=snap; Package: PDIP-8 Texas; MP: LM358N/NOPB; Check_prices: https://www.snapeda.com/parts/LM358N/NOPB/Texas+Instruments/view-part/?ref=eda; Purchase-URL: https://pricing.snapeda.com/search/part/LM358N/NOPB/?ref=eda; Price: None; Value: *; Availability: In Stock
U31 = VOM617A-2T: OPTOISOLATOR 3.75KV TRANS 4-SOP; Solder: SMT; CompanyID: VT-xxxx; MPN: VOM617A-2T; Value: VOM617A-2T
V3 V6 V11 V12 = FGA25N120ANTD: IGBT NPT G40H65DFB ST; MF: ON Semiconductor; Value: *; Digi-Key_Purchase_URL: https://www.digikey.in/product-detail/en/on-semiconductor/FGA25N120ANTDTU/FGA25N120ANTDTU-ND/820640?utm_source=snapeda&utm_medium=aggregator&utm_campaign=symbol; MP: FGA25N120ANTD; Package: TO-3 Fairchild Semiconductor; SnapEDA_Link: https://www.snapeda.com/parts/FGA25N120ANTD/ON%20Semiconductor/view-part/202622/?ref=snap; Digi-Key_Part_Number: FGA25N120ANTDTU-ND
V4 V5 V7-V10 = FGA25N120ANTD: IGBT NPT STGWA80H65DFB; MF: ON Semiconductor; Value: *; Digi-Key_Purchase_URL: https://www.digikey.in/product-detail/en/on-semiconductor/FGA25N120ANTDTU/FGA25N120ANTDTU-ND/820640?utm_source=snapeda&utm_medium=aggregator&utm_campaign=symbol; MP: FGA25N120ANTD; Package: TO-3 Fairchild Semiconductor; SnapEDA_Link: https://www.snapeda.com/parts/FGA25N120ANTD/ON%20Semiconductor/view-part/202622/?ref=snap; Digi-Key_Part_Number: FGA25N120ANTDTU-ND